# EasyEDA Pro project Smart_Plugs.eprj

# Schematic MAIN_IO_EXPANDER
Create Date: 2026-02-11; Page Name: MAIN_IO_EXPANDER; Project Name: Smart_Plugs; Schematic Name: MAIN_IO_EXPANDER; Update Date: 2026-02-14; Address1: *; Address2: *; Address3: *; Address4: *; Application_BuildNumber: *; ApprovedBy: *; Author: *; CheckedBy: *; CompanyName: *; CurrentDate: *; CurrentTime: *; Date: *; DocumentFullPathAndName: *; DocumentName: *; DocumentNumber: *; DrawnBy: *; Engineer: *; ImagePath: *; ModifiedDate: *; Organization: *; ProjectName: *; Revision: *; Rule: *; SheetNumber: 8; SheetTotal: 10; Time: *; Title: *
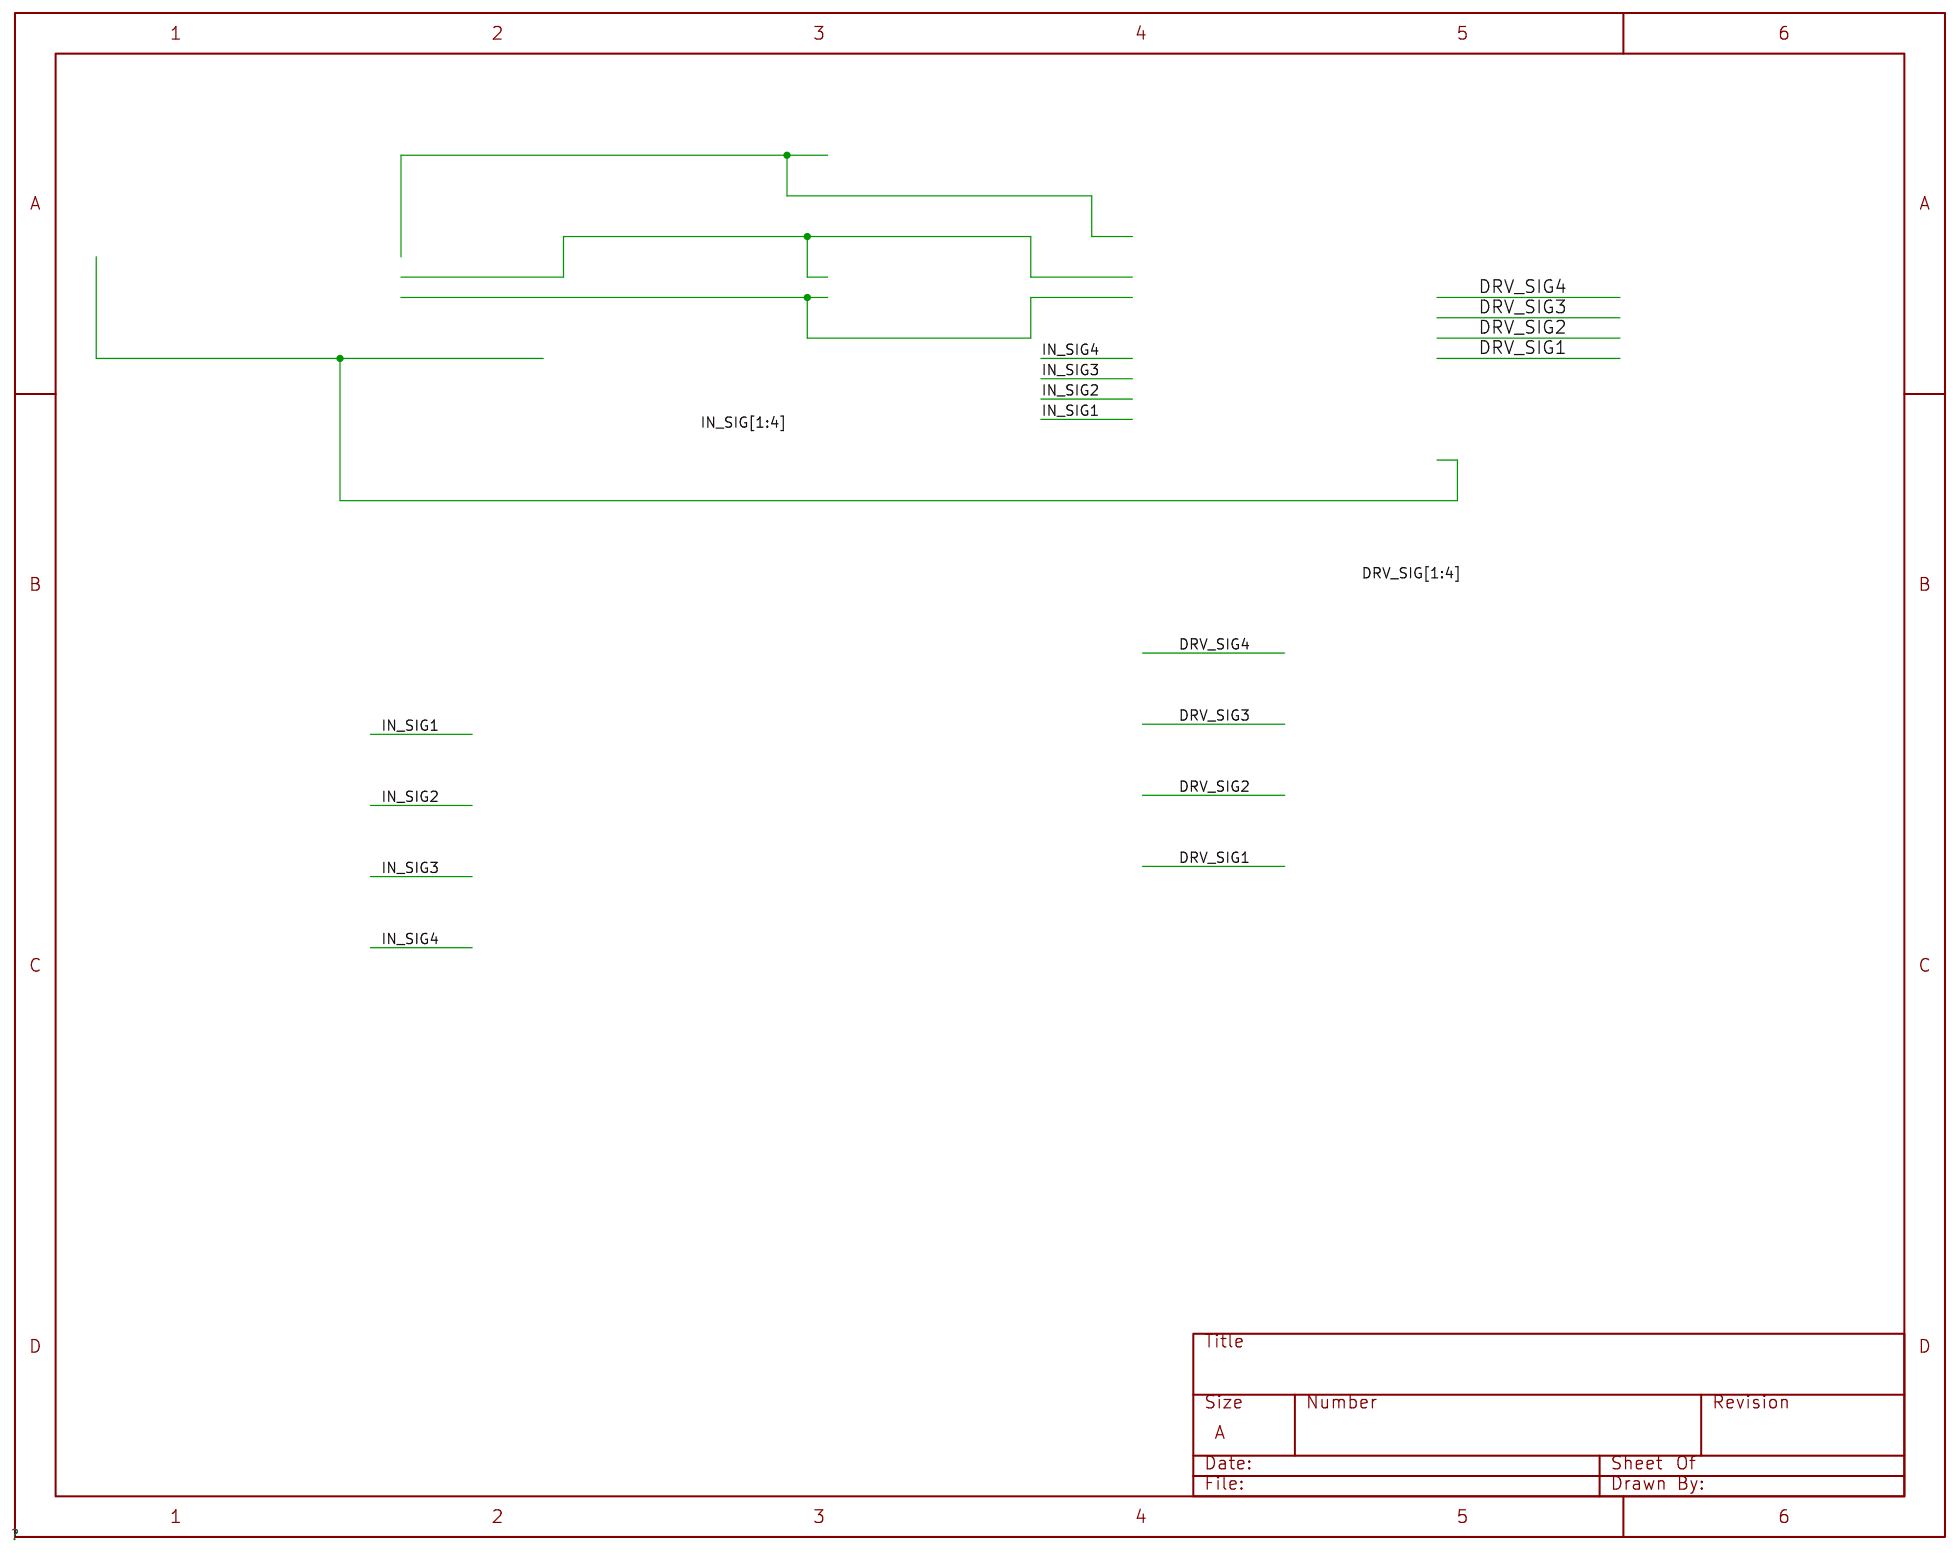
[diagram p0: schematic sheet]

## Parts
Button_Input_Block1  -
Button_Input_Block2  -
Button_Input_Block3  -
Button_Input_Block4  -
RELAY_CHANNEL1  -
RELAY_CHANNEL2  -
RELAY_CHANNEL3  -
RELAY_CHANNEL4  -
U_Earth_Connectors  Earth_Connectors
U_I2C  I2C
U_IO_Expander  IO_Expander
U_IO_Expander_Interrupt_Block101  IO_Expander_Interrupt_Block
U_PSU  PSU
U_System_Controller  System_Controller

## Library data of the parts
U_Earth_Connectors = -: File: Earth_Connectors.SchDoc
U_I2C = -: File: I2C.SchDoc
U_IO_Expander = -: File: IO_Expander.SchDoc
U_IO_Expander_Interrupt_Block101 = -: File: IO_Expander_Interrupt_Block.SchDoc
U_PSU = -: File: PSU.SchDoc
U_System_Controller = -: File: System_Controller.SchDoc

## Nets
DRV_SIG1: Button_Input_Block1.(IN_SIG) Button_Input_Block2.(IN_SIG) Button_Input_Block3.(IN_SIG) Button_Input_Block4.(IN_SIG) U_I2C.(I2C_SDA) U_IO_Expander.(MCP_INT_OUT) U_IO_Expander_Interrupt_Block101.(MCP_INT) U_System_Controller.(I2C_SCL)

Not connected (* = marked no-connect by the designer): RELAY_CHANNEL1 (LED_IND_IN); RELAY_CHANNEL2 (LED_IND_IN); RELAY_CHANNEL3 (LED_IND_IN); RELAY_CHANNEL4 (LED_IND_IN); U_Earth_Connectors (AC_PE); U_PSU (AC_N_FILTERED_OUT)

# Schematic PSU_Input_EMI_Protection_Block
Create Date: 2026-02-11; Page Name: PSU_Input_EMI_Protection; Project Name: Smart_Plugs; Schematic Name: PSU_Input_EMI_Protection_Block; Update Date: 2026-03-02; Address1: *; Address2: *; Address3: *; Address4: *; Application_BuildNumber: *; ApprovedBy: *; Author: *; CheckedBy: *; CompanyName: *; CurrentDate: *; CurrentTime: *; Date: *; DocumentFullPathAndName: *; DocumentName: *; DocumentNumber: *; DrawnBy: *; Engineer: *; ImagePath: *; ModifiedDate: *; Organization: *; Parameter 1: *; ProjectName: *; Revision: *; Rule: *; SheetNumber: 2; SheetTotal: 10; Time: *; Title: *
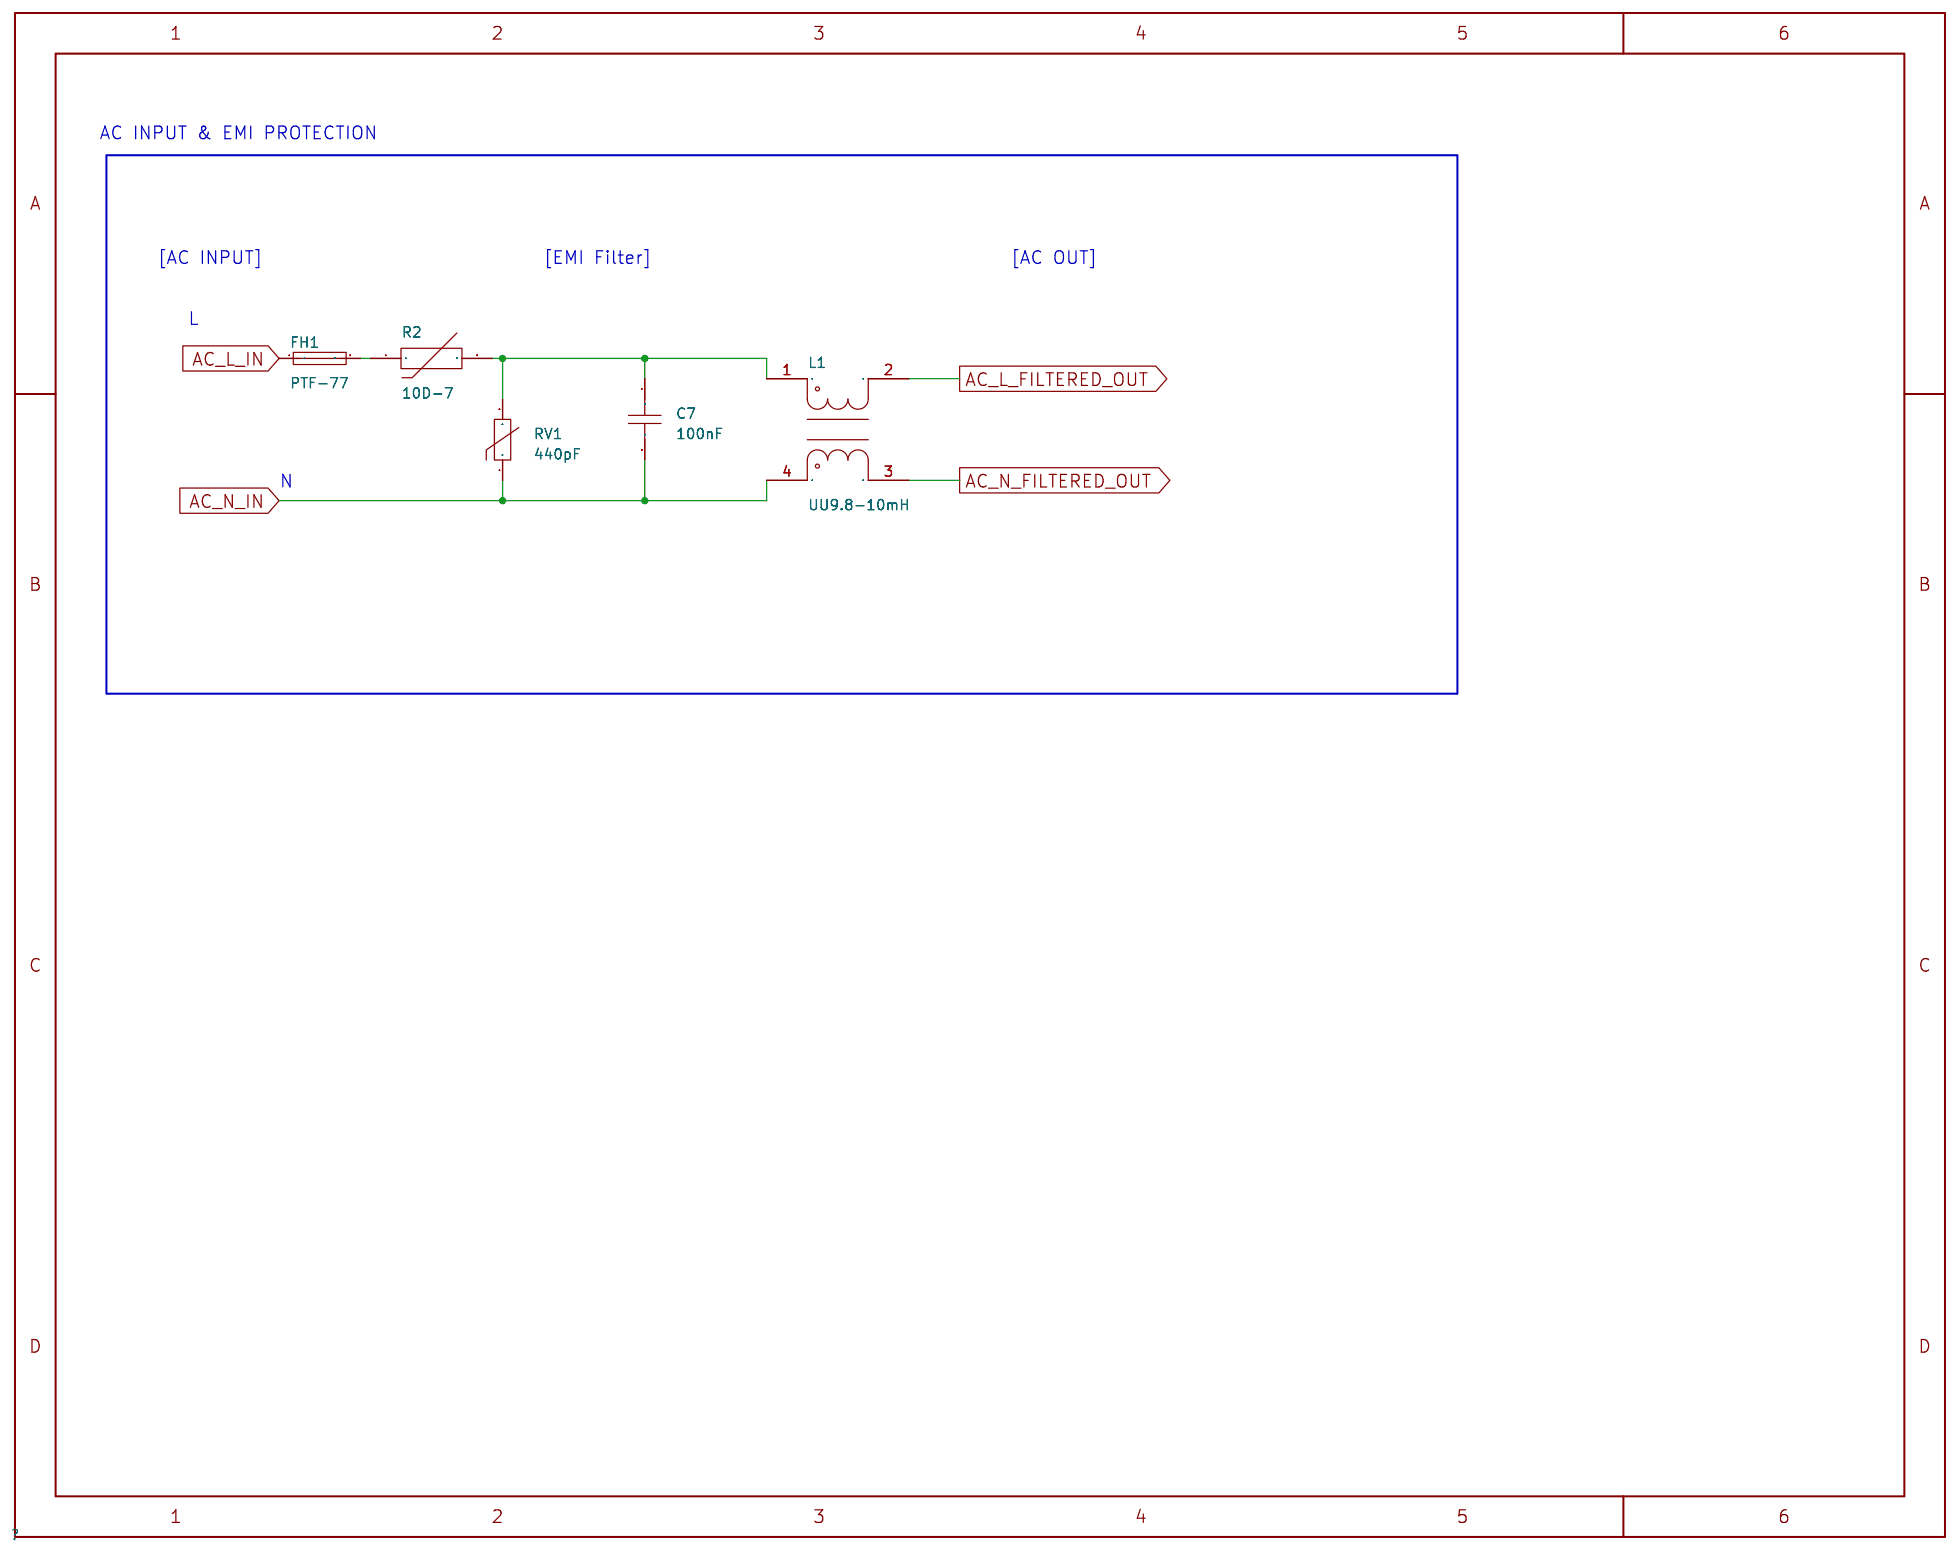
[diagram p1: schematic sheet]

## Parts
C7  100nF  [CAP-TH_L13.0-W6.0-P10.00-D1.0]
FH1  PTF-77  [FUSE-TH_L24.4-W9.4-P22.60]
L1  UU9.8-10mH  [FILTER-TH_4P-L17.0-W12.0-P7.00-D0.6-S8.00]
R2  10D-7  [RES-TH_L9.0-W4.7-P5.00-D1.2-S1.70]
RV1  440pF  [RES-TH_L14.5-W6.0-P7.50-D0.8-S6.0]

## Library data of the parts
C7 = MP2104K27C3X6LC: LCSC Part Name: 100nF ±10% 275V 等级:X2; Supplier Part: C105759; Manufacturer: SRD(圣融达); Supplier Footprint: 插件,P=10mm; JLCPCB Part Class: Extended Part; Datasheet: https://item.szlcsc.com/datasheet/MP2104K27C3X6LC/106974.html; Supplier: LCSC; Tolerance: ±10%; Voltage(AC): 275V; Ratings: X2; safety certification: UL；ENEC；VDE；CQC；CSA
FH1 = PTF-77: LCSC Part Name: 2件套 保险丝座 5x20mm 绿色; Supplier Part: C717030; Manufacturer: XFCN(兴飞); Supplier Footprint: 插件,P=22.5mm; JLCPCB Part Class: Extended Part; Datasheet: https://item.szlcsc.com/datasheet/PTF-77/757629.html; Supplier: LCSC; Fuseholder Type: Bracket type; Number of Circuits: 1; Voltage Rating: 250V; Current Rating: 20A; Fuse Type: Cylindrical; Fuse Diameter (φD): 5mm; Fuse Length: 20mm
L1 = UU9.8-10mH: LCSC Part Name: 两路 插件共模滤波器; Supplier Part: C148474; Manufacturer: FH(风华); Supplier Footprint: DIP-4P,17x12mm; Datasheet: https://item.szlcsc.com/datasheet/UU9.8-10mH/159808.html; Supplier: LCSC; Number of Lines: 2; Voltage Withstand: 1kV; Current Rating: 500mA; Inductance @ Frequency: 10mH@1kHz; DC Resistance(DCR): 800mΩ; Operating Temperature: -25℃~+85℃; Insulation Resistance(IR): 100MΩ
R2 = 10D-7: LCSC Part Name: 10Ω 2700K NTC热敏电阻; Supplier Part: C332360; Manufacturer: HEL(鸿志); Supplier Footprint: 插件,P=5mm; JLCPCB Part Class: Extended Part; Datasheet: https://item.szlcsc.com/datasheet/10D-7/311113.html; Supplier: LCSC; Resistance @ 25℃: 10Ω; B Constant (25℃/50℃): 2700K; B Constant (25℃/85℃): 2700K; Steady State Current (Max): 1A; Operating Temperature: -40℃~+150℃; Dissipation Factor: 6mW/℃; Thermal Time Constant: 20s; Pitch: 5mm
RV1 = 14D431K_C49069732: LCSC Part Name: 710V 136J; Supplier Part: C49069732; Manufacturer: R+O(宏嘉诚); Manufacturer Part: 14D431K; Supplier Footprint: 插件,P=7.5mm; JLCPCB Part Class: Extended Part; Datasheet: https://item.szlcsc.com/datasheet/14D431K/51445298.html; Supplier: LCSC; Varistor Voltage: 387V~473V; Clamping Voltage: 710V; Maximum DC Volts: 350V; Maximum AC Volts: 275V; Peak Current: 4.5kA; Energy: 136J; Rated Wattage: 600mW

## Nets
AC_L_FILTERED_OUT: L1.2
AC_L_IN: FH1.1
AC_N_FILTERED_OUT: L1.3
AC_N_IN: C7.2 L1.4 RV1.1
Net-(C7-1): C7.1 L1.1 R2.2 RV1.2
Net-(FH1-2): FH1.2 R2.1

## Notes on the sheet
- AC INPUT & EMI PROTECTION
- [AC INPUT]
- [EMI Filter]
- [AC OUT]
- L
- N

# Schematic Relay_Channel_HF115F
Create Date: 2026-02-11; Page Name: Relay_Channel_HF115F; Project Name: Smart_Plugs; Schematic Name: Relay_Channel_HF115F; Update Date: 2026-03-13; Address1: *; Address2: *; Address3: *; Address4: *; Application_BuildNumber: *; ApprovedBy: *; Author: *; CheckedBy: *; CompanyName: *; CurrentDate: *; CurrentTime: *; Date: *; DocumentFullPathAndName: *; DocumentName: *; DocumentNumber: *; DrawnBy: *; Engineer: *; ImagePath: *; ModifiedDate: *; Organization: *; ProjectName: *; Revision: *; Rule: *; SheetNumber: 8; SheetTotal: 10; Time: *; Title: *
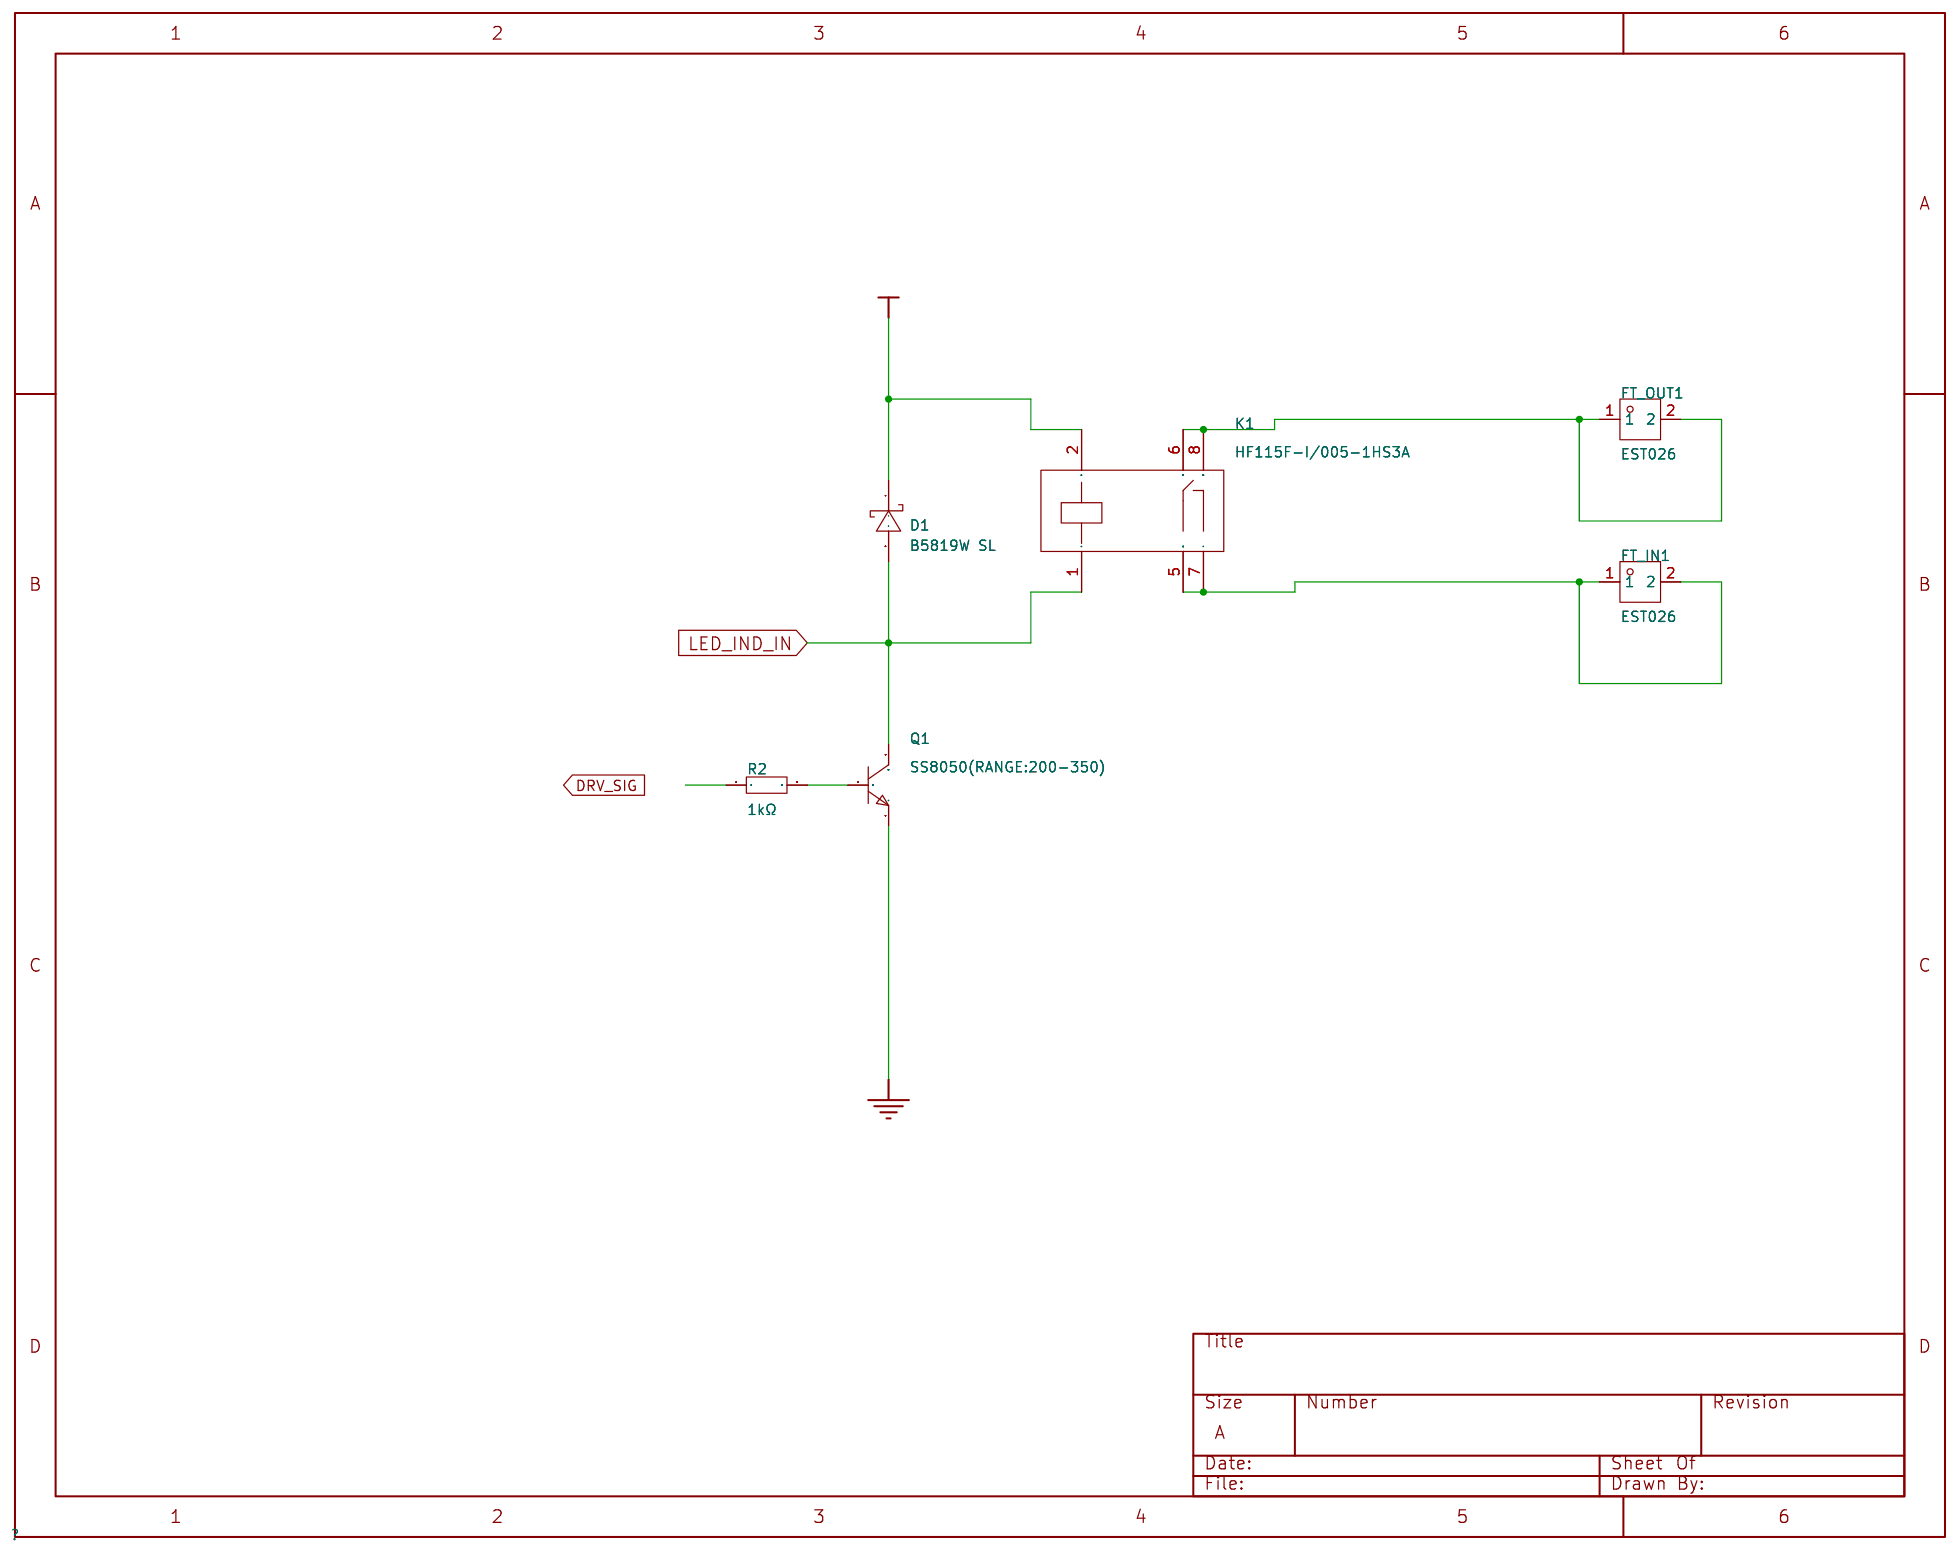
[diagram p2: schematic sheet]

## Parts
D1  B5819W SL  [SOD-123_L2.7-W1.6-LS3.7-RD-1]
FT_IN1  EST026  [CONN-TH_L6.3-W0.8-EST026]
FT_OUT1  EST026  [CONN-TH_L6.3-W0.8-EST026]
K1  HF115F-I/005-1HS3A  [RELAY-TH_HF115F-XXX-1HS3]
Q1  SS8050(RANGE:200-350)  [SOT-23-3_L2.9-W1.3-P1.90-LS2.4-BR]
R2  1kΩ  [R0805]

## Library data of the parts
D1 = B5819W SL: LCSC Part Name: 电压:40V 电流:1A; Supplier Part: C8598; Manufacturer: CJ(江苏长电/长晶); Supplier Footprint: SOD-123; Datasheet: https://item.szlcsc.com/datasheet/B5819W%2520SL/9093.html; Supplier: LCSC; Voltage - Forward(Vf@If): 600mV@1A; Voltage - DC Reverse(Vr): 40V; Current - Rectified: 1A; Non-Repetitive Peak Forward Surge Current: 9A
FT_IN1 FT_OUT1 = EST026: LCSC Part Name: 插片端子-6.3mm; Supplier Part: C52878; Manufacturer: xcfuse(旭程); Supplier Footprint: 插件; JLCPCB Part Class: Extended Part; Datasheet: https://item.szlcsc.com/datasheet/EST026/53893.html; Supplier: LCSC
K1 = HF115F-I/005-1HS3A: LCSC Part Name: 小型大功率5V继电器 单刀单掷-常开 TV-5; Supplier Part: C2976795; Manufacturer: HF(宏发); Supplier Footprint: DIP,29x12.7mm; JLCPCB Part Class: Extended Part; Datasheet: https://item.szlcsc.com/datasheet/HF115F-I%252F005-1HS3A/3385015.html; Supplier: LCSC; Coil Voltage: 5V; Contact Form: 1 Set Normally Open: 1A (SPST NO); Number of Pins: 6; Contact Rating: 16A@250VAC; Switching Voltage(Max): 440V@AC；300V@DC; Coil Rated Power: 400mW; Contact Material: AgSnO2; Switching Current(Max): 16A; Coil Type: Non-Polarized - Single Coil; Coil Resistance: 62Ω; Contact Resistance: 100mΩ; Operate Time: 15ms; Release Time: 8ms; Operating Temperature: -40℃~+85℃
Q1 = SS8050(RANGE:200-350)_C2150: LCSC Part Name: hfe=200~350 NPN 电流:1.5A 电压:25V; Supplier Part: C2150; Manufacturer: CJ(江苏长电/长晶); Supplier Footprint: SOT-23; JLCPCB Part Class: Basic Part; Datasheet: https://item.szlcsc.com/datasheet/SS8050(RANGE%253A200-350)/2507.html; Supplier: LCSC; type: NPN; Current - Collector(Ic): 1.5A; Collector - Emitter Voltage VCEO: 25V; Pd - Power Dissipation: 300mW; DC Current Gain: 200@800mA,1V; Transition frequency(fT): 100MHz; Current - Collector Cutoff: 100nA; Vce Saturation(VCE(sat)): 500mV@800mA,80mA; Operating Temperature: -55℃~+150℃; Emitter-Base Voltage(Vebo): 5V; Number: 1 NPN
R2 = 0805W8F1001T5E: LCSC Part Name: 1kΩ ±1% 125mW 厚膜电阻; Supplier Part: C17513; Manufacturer: UNI-ROYAL(厚声); Supplier Footprint: 0805; Datasheet: https://atta.szlcsc.com/upload/public/pdf/source/20200306/C422600_1E6D84923E4A46A82E41ADD87F860B5C.pdf; Supplier: LCSC; Type: Thick Film Resistors; Tolerance: ±1%; Temperature Coefficient: ±100ppm/℃; Operating Temperature Range: -55℃~+155℃

## Nets
+5V: D1.1(-) K1.2
GND: Q1.2(E)
DRV_SIG: R2.1
LED_IND_IN: D1.2(+) K1.1 Q1.3(C)
Net-(FT_IN1-1): FT_IN1.1 FT_IN1.2 K1.5 K1.7
Net-(FT_OUT1-1): FT_OUT1.1 FT_OUT1.2 K1.6 K1.8
Net-(Q1-1): Q1.1(B) R2.2

# Schematic IO_Expander_1
Create Date: 2026-02-11; Page Name: IO_Expander; Project Name: Smart_Plugs; Schematic Name: IO_Expander_1; Update Date: 2026-02-11; Address1: *; Address2: *; Address3: *; Address4: *; Application_BuildNumber: *; ApprovedBy: *; Author: *; CheckedBy: *; CompanyName: *; CurrentDate: *; CurrentTime: *; Date: *; DocumentFullPathAndName: *; DocumentName: *; DocumentNumber: *; DrawnBy: *; Engineer: *; ImagePath: *; ModifiedDate: *; Organization: *; ProjectName: *; Revision: *; Rule: *; SheetNumber: 8; SheetTotal: 10; Time: *; Title: *
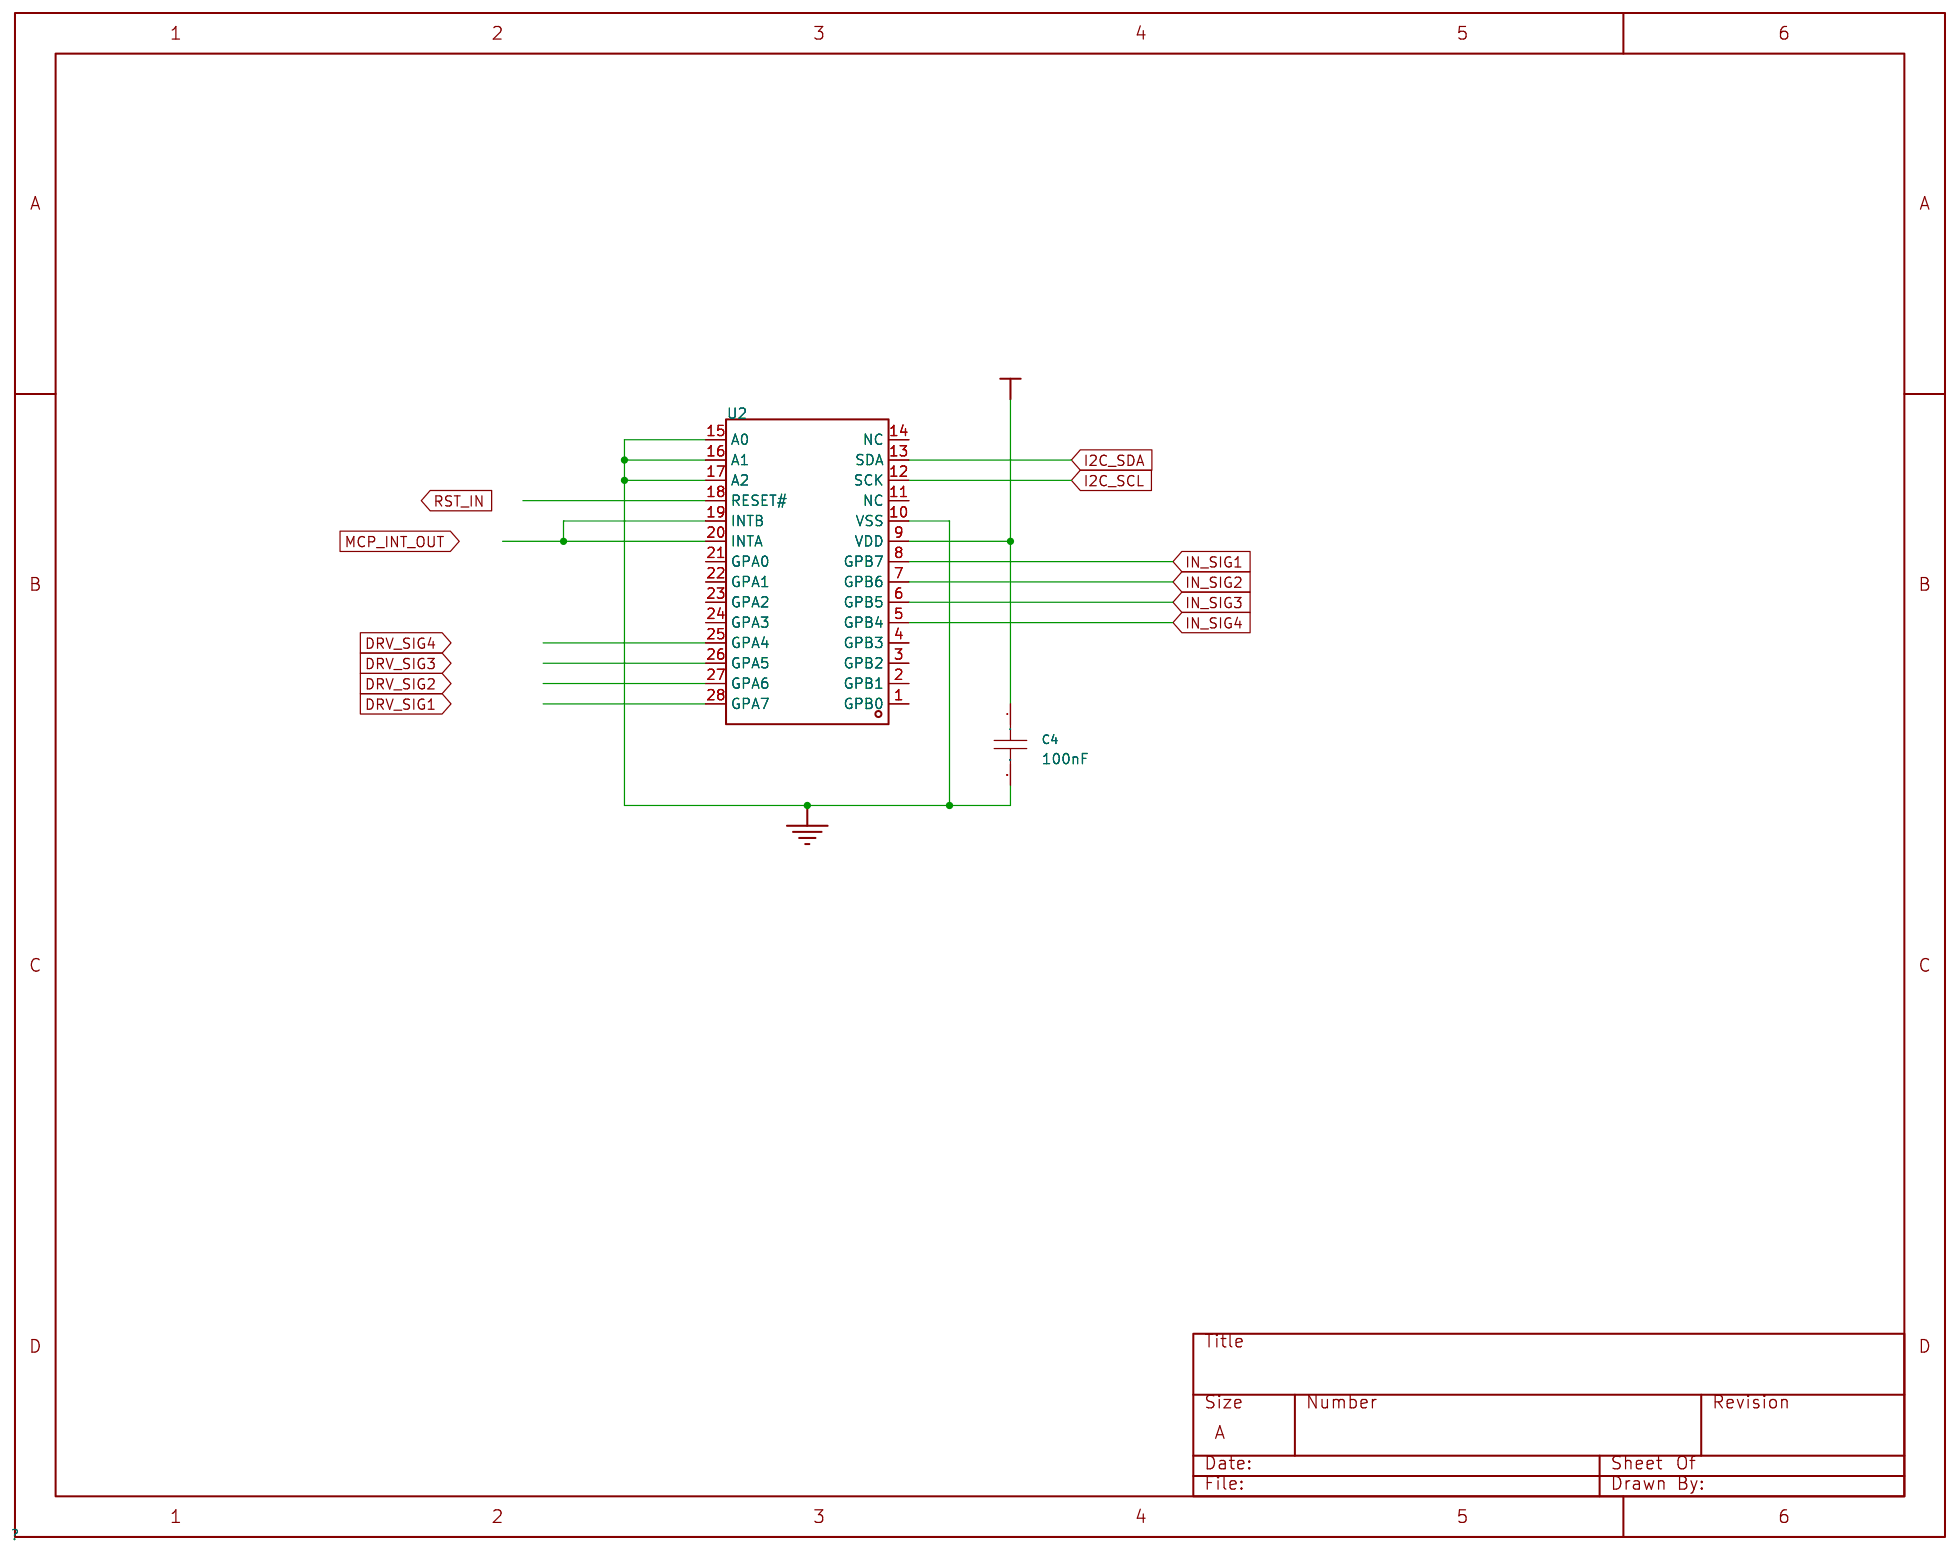
[diagram p3: schematic sheet]

## Parts
C4  100nF  [CAP-TH_L4.0-W2.5-P5.00-D1.0]
U2  MCP23017-E/SS  [SSOP-28_L10.2-W5.3-P0.65-LS7.8-BL]

## Library data of the parts
C4 = FG28X7R1H104KNT06: LCSC Part Name: 100nF ±10% 50V; Supplier Part: C342794; Manufacturer: TDK; Supplier Footprint: 插件,P=5mm; JLCPCB Part Class: Extended Part; Datasheet: https://item.szlcsc.com/datasheet/FG28X7R1H104KNT06/319644.html; Supplier: LCSC; Tolerance: ±10%; Voltage Rating: 50V; Temperature Coefficient: X7R; Pin Spacing: 5mm
U2 = MCP23017-E/SS: LCSC Part Name: 16位带串行接口的I/O扩展器; Manufacturer: MICROCHIP(美国微芯); JLCPCB Part Class: Extended Part; Datasheet: https://item.szlcsc.com/datasheet/MCP23017-E%252FSS/519857.html; Interface: I2C; Number of I/O: 16; Interrupt Output: Interrupt Output; Voltage - Supply: 1.8V~5.5V; Current - Output Low(IOL): 8mA; Clock Frequency: 1.7MHz; Operating Temperature: -40℃~+125℃; Number of Supporting Devices: 8; Quiescent Current: 1uA; Output Logic Level - Low: 600mV; Supplier Part: C506653; Supplier Footprint: SSOP-28(5.3x10.2x0.65); Supplier: LCSC; Library Name: MCP23017-E-SS

## Nets
+3V3: C4.1 U2.9(VDD)
GND: C4.2 U2.10(VSS) U2.15(A0) U2.16(A1) U2.17(A2)
DRV_SIG1: U2.28(GPA7)
DRV_SIG2: U2.27(GPA6)
DRV_SIG3: U2.26(GPA5)
DRV_SIG4: U2.25(GPA4)
I2C_SCL: U2.12(SCK)
I2C_SDA: U2.13(SDA)
IN_SIG1: U2.8(GPB7)
IN_SIG2: U2.7(GPB6)
IN_SIG3: U2.6(GPB5)
IN_SIG4: U2.5(GPB4)
MCP_INT_OUT: U2.19(INTB) U2.20(INTA)
RST_IN: U2.18(RESET#)

Not connected (* = marked no-connect by the designer): U2 1(GPB0) 2(GPB1) 3(GPB2) 4(GPB3) 11(NC) 14(NC) 21(GPA0) 22(GPA1) 23(GPA2) 24(GPA3)

# Schematic I2C
Create Date: 2026-02-11; Page Name: I2C; Project Name: Smart_Plugs; Schematic Name: I2C; Update Date: 2026-02-14; Address1: *; Address2: *; Address3: *; Address4: *; Application_BuildNumber: *; ApprovedBy: *; Author: *; CheckedBy: *; CompanyName: *; CurrentDate: *; CurrentTime: *; Date: *; DocumentFullPathAndName: *; DocumentName: *; DocumentNumber: *; DrawnBy: *; Engineer: *; ImagePath: *; ModifiedDate: *; Organization: *; ProjectName: *; Revision: *; Rule: *; SheetNumber: 8; SheetTotal: 10; Time: *; Title: *
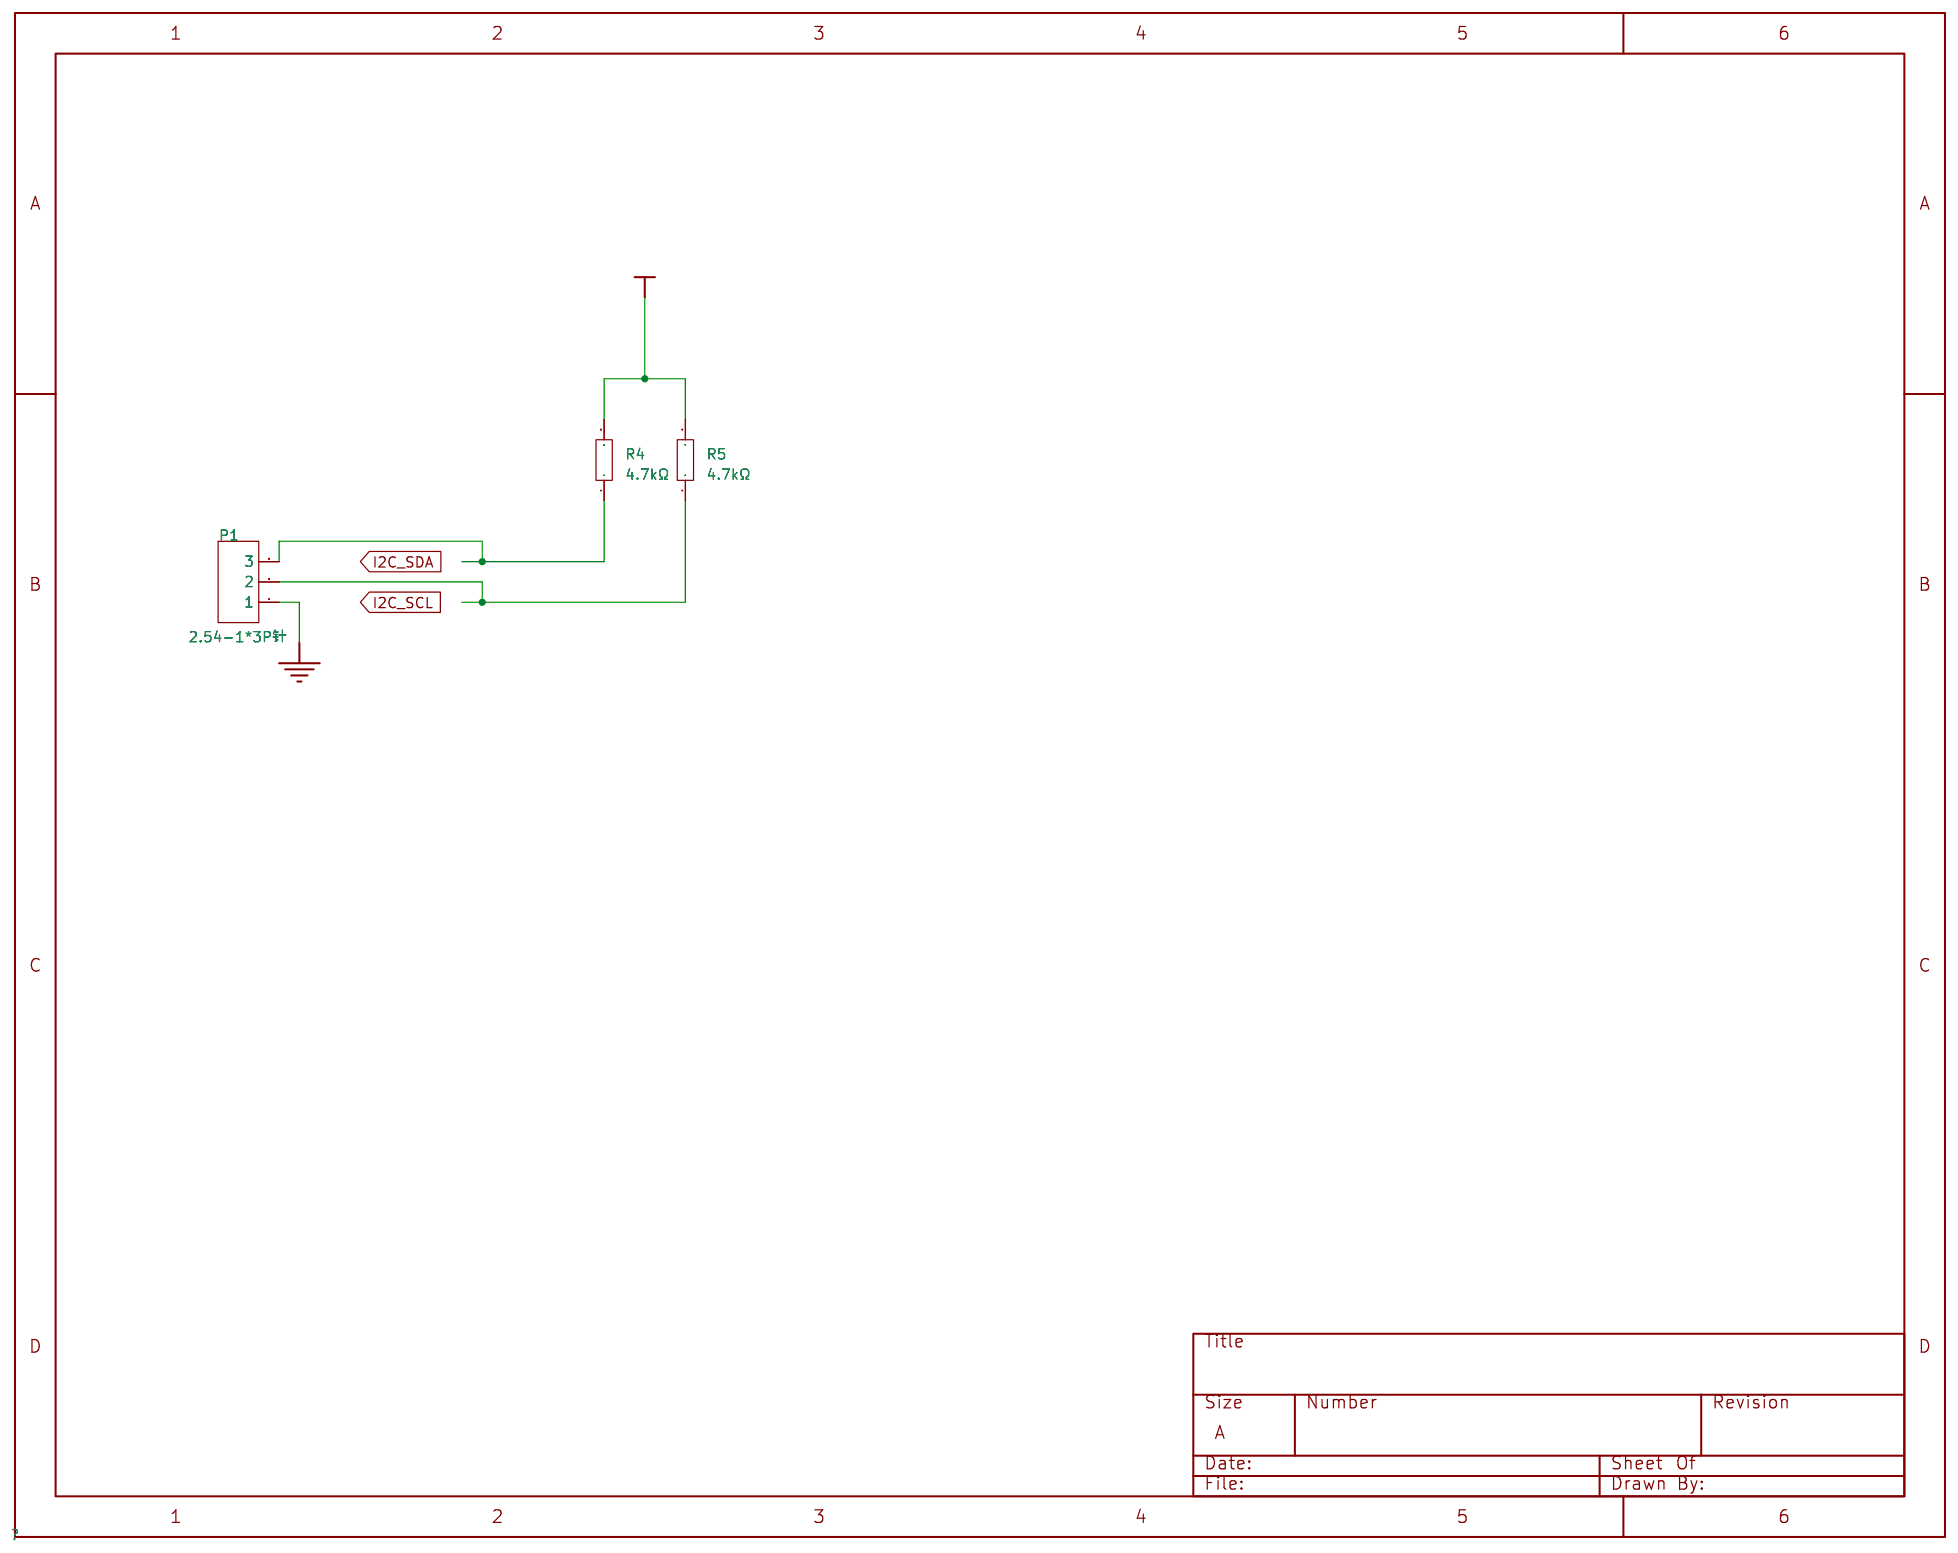
[diagram p4: schematic sheet]

## Parts
P1  2.54-1*3P针  [HDR-TH_3P-P2.54-V-M-1]
R4  4.7kΩ  [R0805]
R5  4.7kΩ  [R0805]

## Library data of the parts
P1 = 2.54-1*3P针: LCSC Part Name: 1x3P 间距:2.54mm 方针 直插; Supplier Part: C49257; Manufacturer: BOOMELE(博穆精密); Supplier Footprint: 插件,P=2.54mm; JLCPCB Part Class: Extended Part; Datasheet: https://item.szlcsc.com/datasheet/2.54-1*3P%25E9%2592%2588/50265.html; Supplier: LCSC; Pin Structure: 1x3P; Pitch: 2.54mm; Circluar Pins/Square Pins: Pin Header; Mounting Type: Through Hole; Number of Rows: 1; Number of Pins: 3P; Current Rating: 3A; Length of Mating Pin: 6mm; Insulation Height: 2.5mm; Length of End Connection Pin: 3mm; Contact Material: Brass; Contact Plating: Gold; Operating Temperature: -40℃~+105℃; Color: Black
R4 R5 = 0805W8F4701T5E: LCSC Part Name: 4.7kΩ ±1% 125mW 厚膜电阻; Supplier Part: C17673; Manufacturer: UNI-ROYAL(厚声); Supplier Footprint: 0805; JLCPCB Part Class: Basic Part; Datasheet: https://atta.szlcsc.com/upload/public/pdf/source/20200306/C422600_1E6D84923E4A46A82E41ADD87F860B5C.pdf; Supplier: LCSC; Type: Thick Film Resistors; Tolerance: ±1%; Temperature Coefficient: ±100ppm/℃; Operating Temperature Range: -55℃~+155℃

## Nets
+3V3: R4.2 R5.2
GND: P1.1
I2C_SCL: P1.2 R5.1
I2C_SDA: P1.3 R4.1

# Schematic IO_Expander_Interrupt_Block_1
Create Date: 2026-02-11; Page Name: IO_Expander_Interrupt_Block; Project Name: Smart_Plugs; Schematic Name: IO_Expander_Interrupt_Block_1; Update Date: 2026-02-14; Address1: *; Address2: *; Address3: *; Address4: *; Application_BuildNumber: *; ApprovedBy: *; Author: *; CheckedBy: *; CompanyName: *; CurrentDate: *; CurrentTime: *; Date: *; DocumentFullPathAndName: *; DocumentName: *; DocumentNumber: *; DrawnBy: *; Engineer: *; ImagePath: *; ModifiedDate: *; Organization: *; ProjectName: *; Revision: *; Rule: *; SheetNumber: 8; SheetTotal: 10; Time: *; Title: *
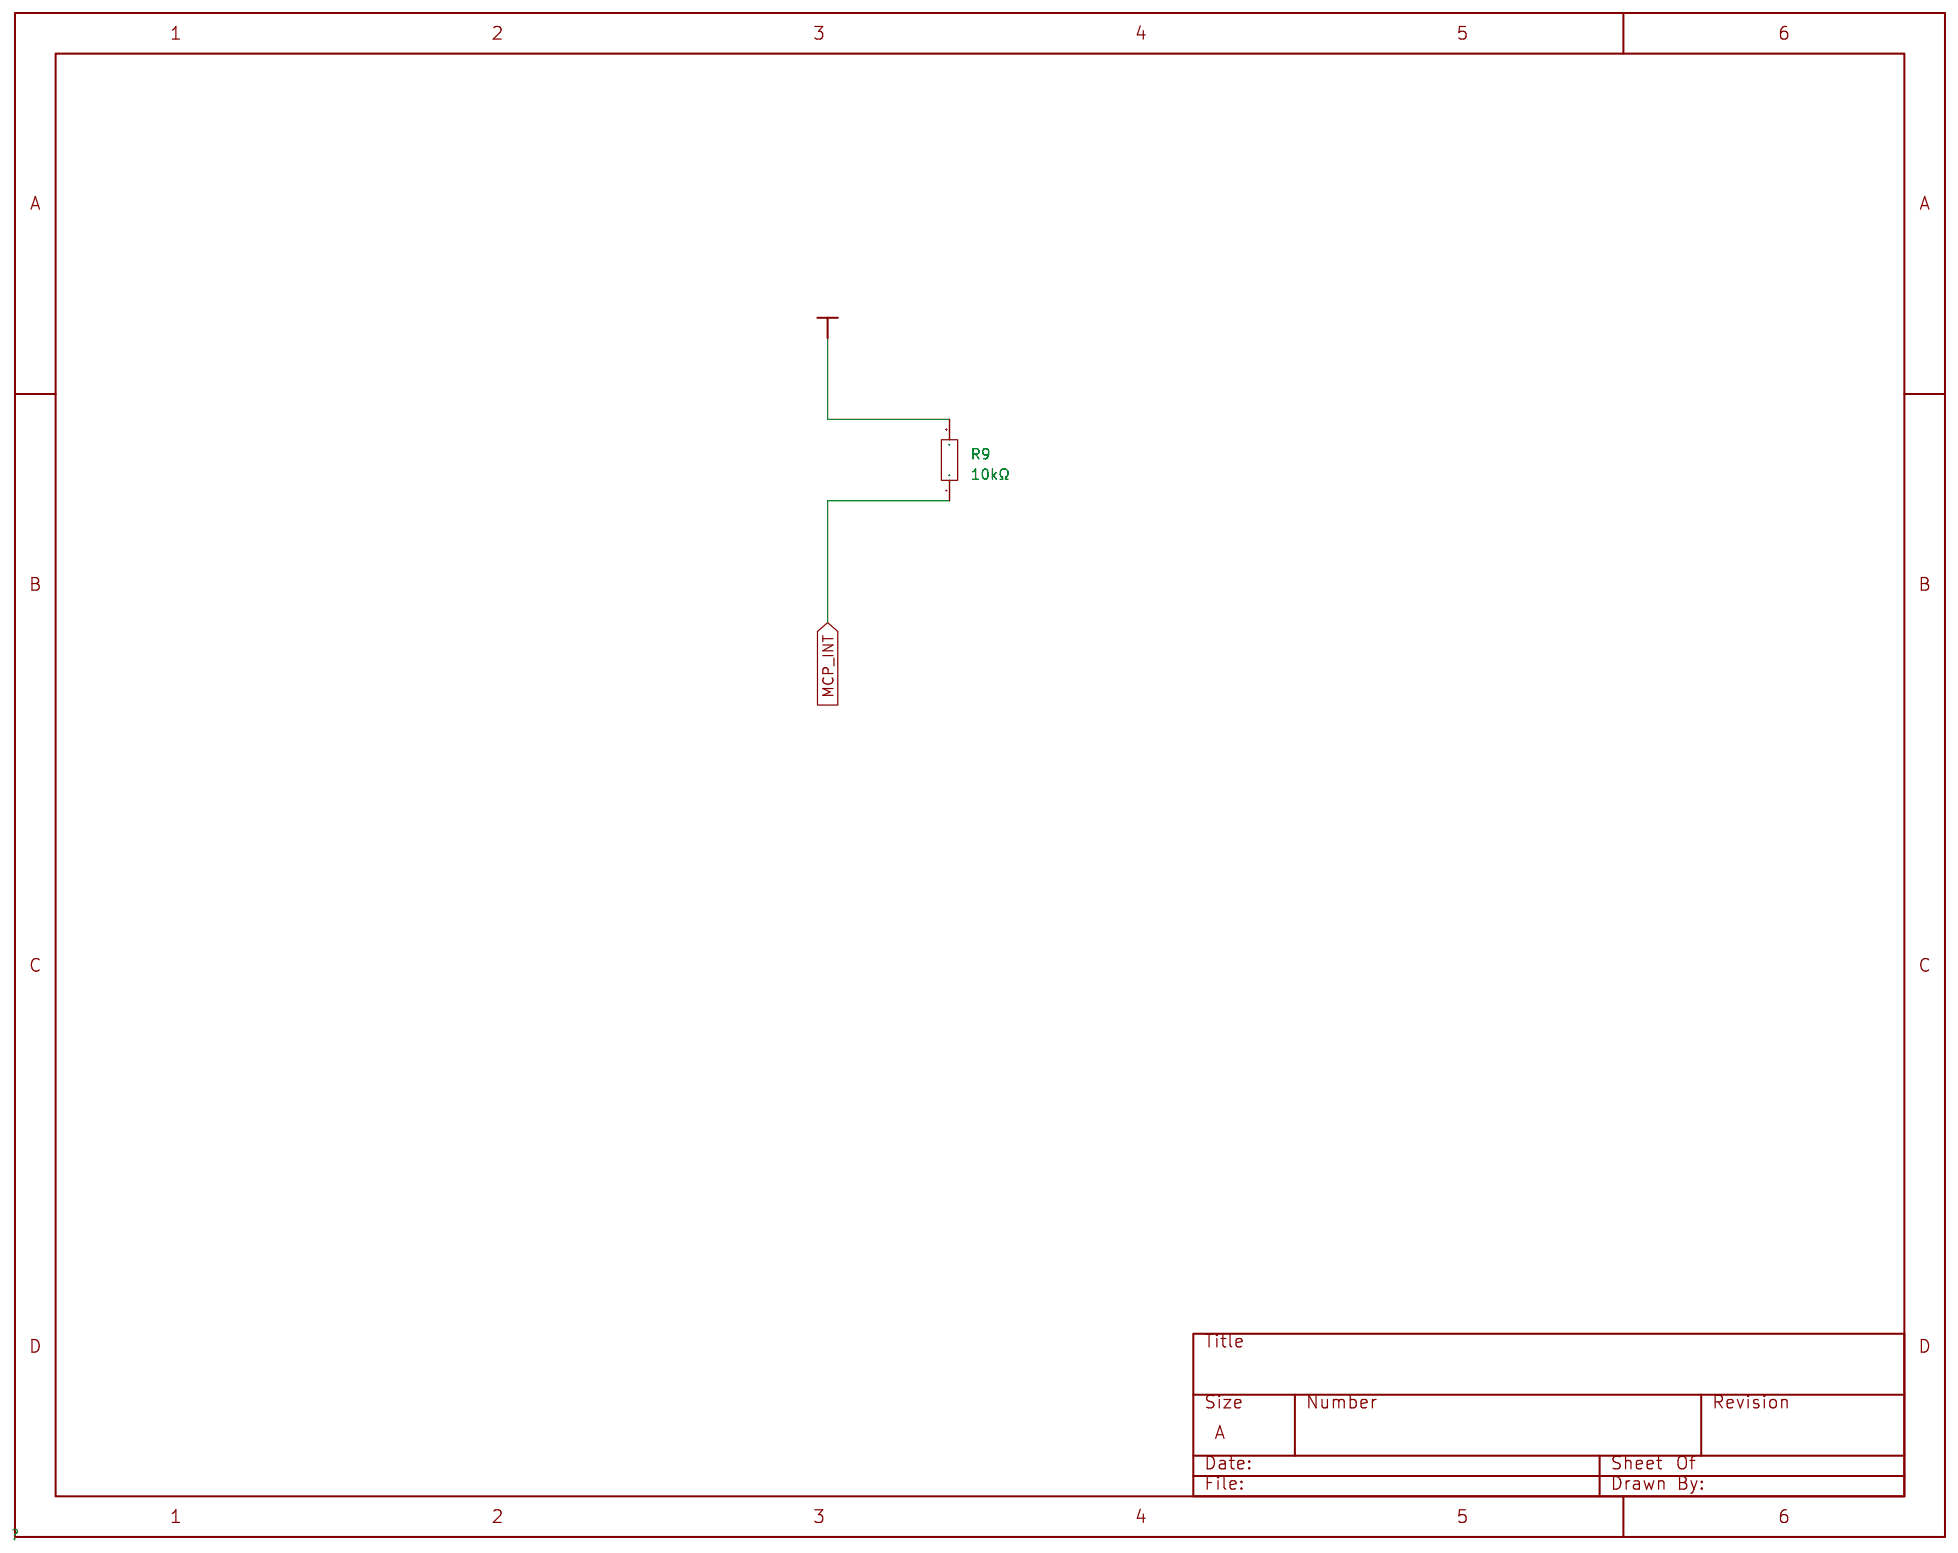
[diagram p5: schematic sheet]

## Parts
R9  10kΩ  [R0805]

## Library data of the parts
R9 = 0805W8F1002T5E: LCSC Part Name: 10kΩ ±1% 125mW 厚膜电阻; Supplier Part: C17414; Manufacturer: UNI-ROYAL(厚声); Supplier Footprint: 0805; JLCPCB Part Class: Basic Part; Datasheet: https://item.szlcsc.com/datasheet/0805W8F1002T5E/18102.html; Supplier: LCSC; Type: Thick Film Resistor; Tolerance: ±1%; Power(Watts): 125mW; Voltage-Supply(Max): 150V; Temperature Coefficient: ±100ppm/℃; Operating Temperature: -55℃~+155℃

## Nets
+3V3: R9.2
MCP_INT: R9.1

# Schematic System_Controller_Header
Create Date: 2026-02-11; Page Name: System_Controller_Header; Project Name: Smart_Plugs; Schematic Name: System_Controller_Header; Update Date: 2026-02-14; Address1: *; Address2: *; Address3: *; Address4: *; Application_BuildNumber: *; ApprovedBy: *; Author: *; CheckedBy: *; CompanyName: *; CurrentDate: *; CurrentTime: *; Date: *; DocumentFullPathAndName: *; DocumentName: *; DocumentNumber: *; DrawnBy: *; Engineer: *; ImagePath: *; ModifiedDate: *; Organization: *; ProjectName: *; Revision: *; Rule: *; SheetNumber: 8; SheetTotal: 10; Time: *; Title: *
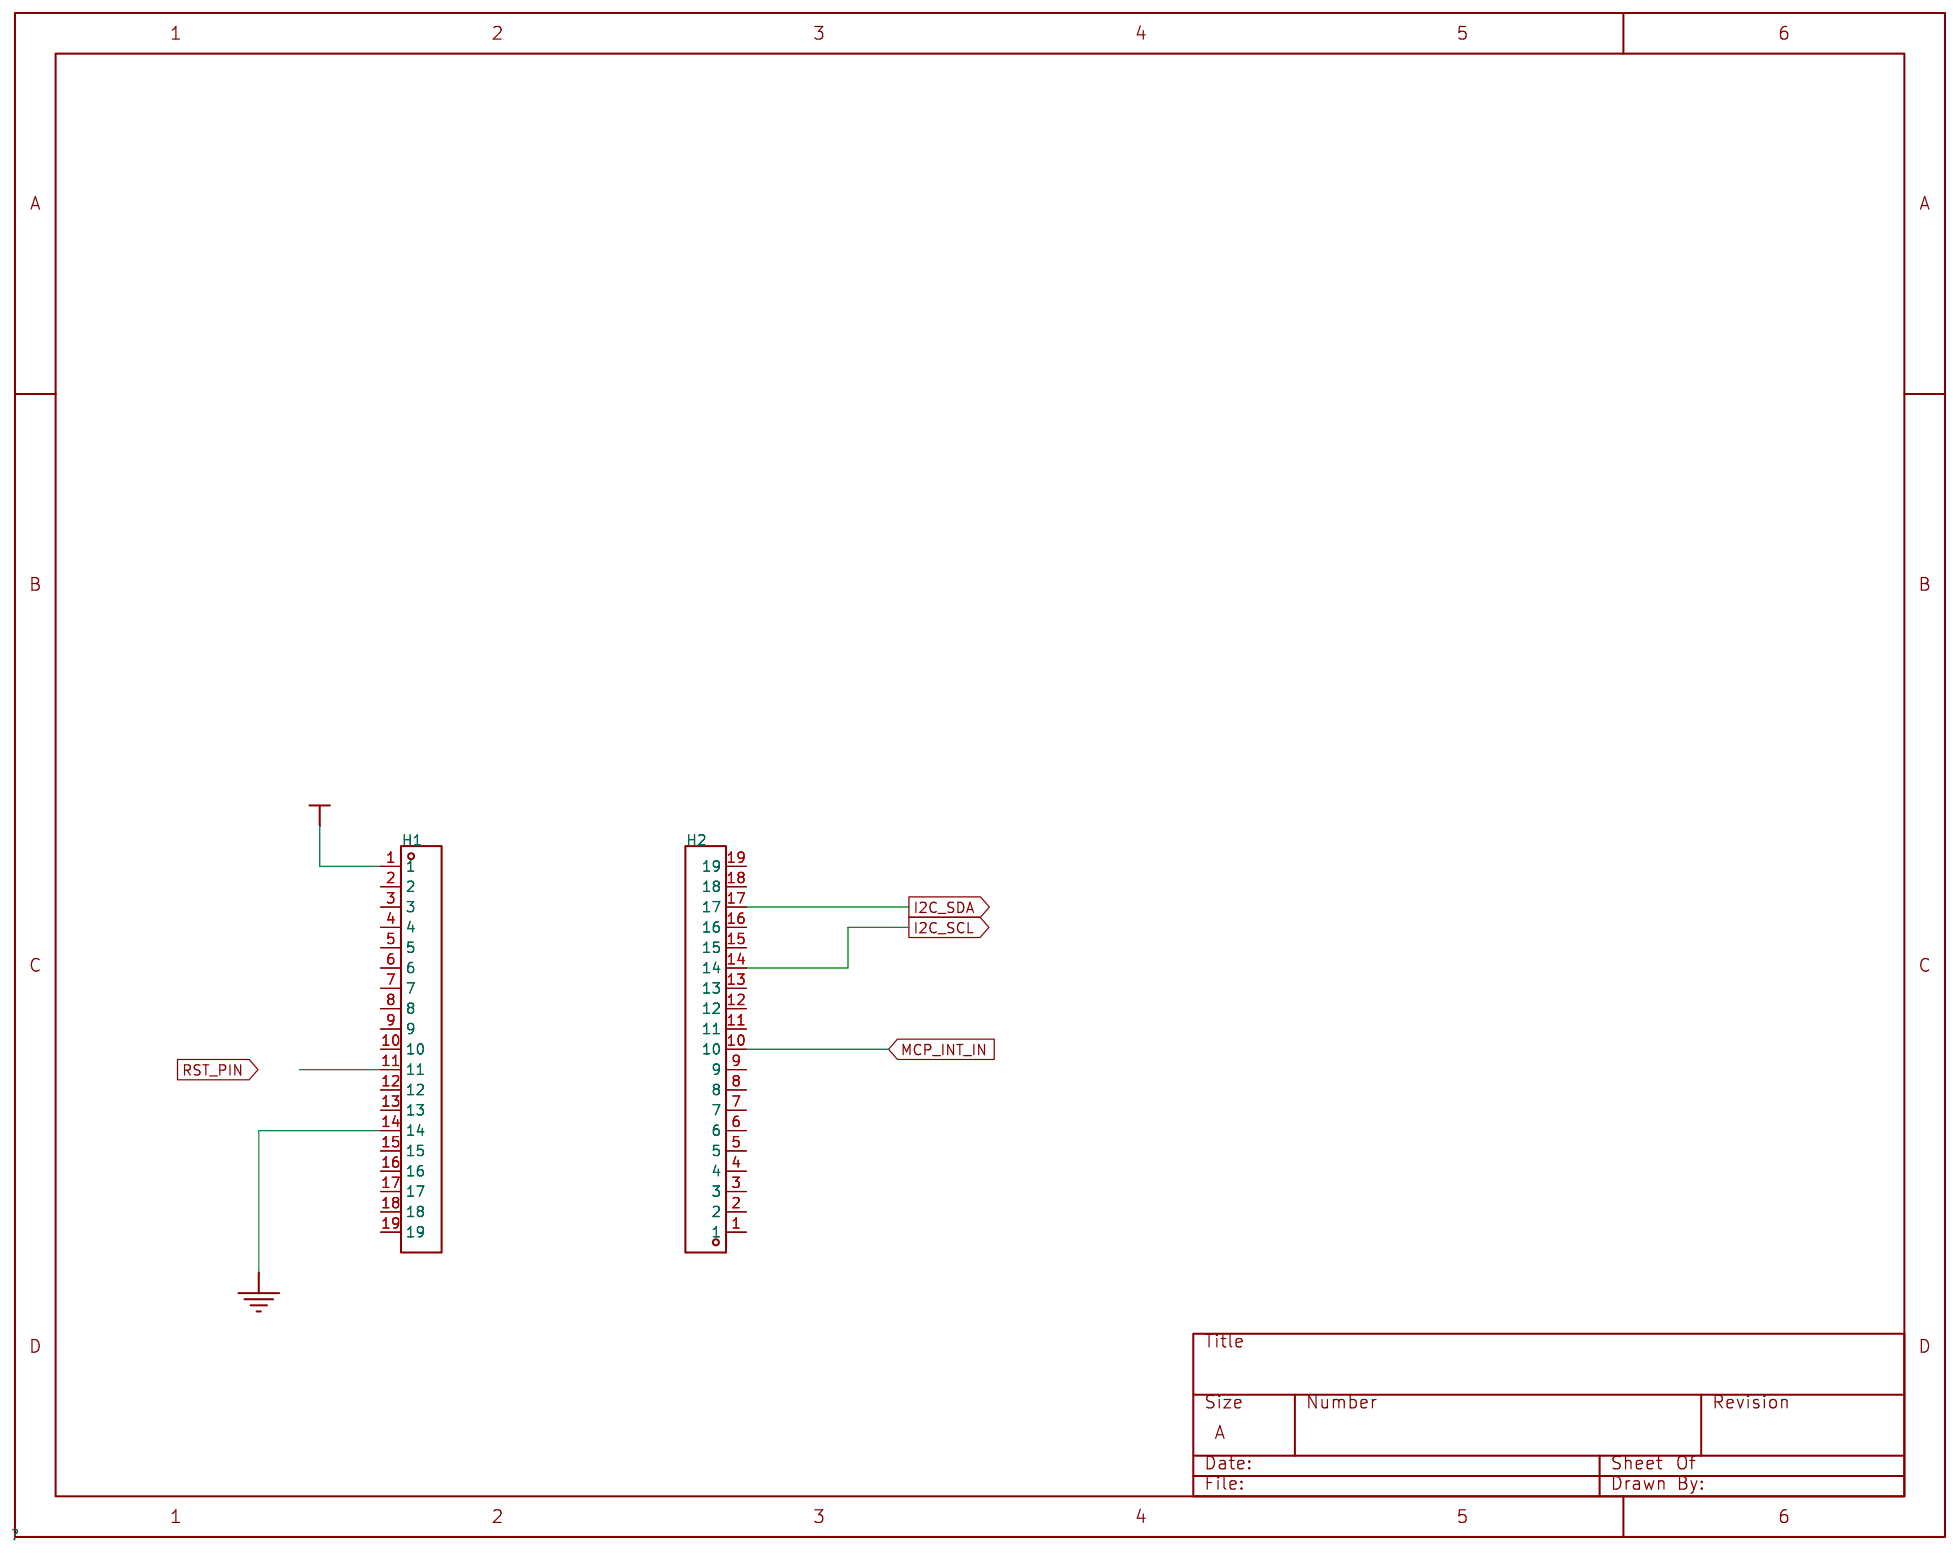
[diagram p6: schematic sheet]

## Parts
H1  2.54-1*19P母  [HDR-TH_19P-P2.54-V-F]
H2  2.54-1*19P母  [HDR-TH_19P-P2.54-V-F]

## Library data of the parts
H1 H2 = 2.54-1*19P母: LCSC Part Name: 间距:2.54mm 直插; Manufacturer: BOOMELE(博穆精密); Supplier Footprint: 插件,P=2.54mm; JLCPCB Part Class: Extended Part; Pitch: 2.54mm; Circular Hole / Square Hole: Square Hole; Mounting Type: Through Hole; Number of Rows: 1; Number of Positions: 19P; Holes Direction: Top; Supplier: LCSC; Supplier Part: C319202; Library Name: 2_54-1x19

## Nets
+3V3: H1.1
GND: H1.14
I2C_SCL: H2.14
I2C_SDA: H2.17
MCP_INT_IN: H2.10
RST_PIN: H1.11

Not connected (* = marked no-connect by the designer): H1 2 3 4 5 6 7 8 9 10 12 13 15 16 17 18 19; H2 1 2 3 4 5 6 7 8 9 11 12 13 15 16 18 19

# Schematic System_Controller
Create Date: 2026-02-14; Page Name: System_Controller; Project Name: Smart_Plugs; Schematic Name: System_Controller; Update Date: 2026-03-09; Address1: *; Address2: *; Address3: *; Address4: *; Application_BuildNumber: *; ApprovedBy: *; Author: *; CheckedBy: *; CompanyName: *; CurrentDate: *; CurrentTime: *; Date: *; DocumentFullPathAndName: *; DocumentName: *; DocumentNumber: *; DrawnBy: *; Engineer: *; ImagePath: *; ModifiedDate: *; Organization: *; ProjectName: *; Revision: *; Rule: *; SheetNumber: 8; SheetTotal: 10; Time: *; Title: *
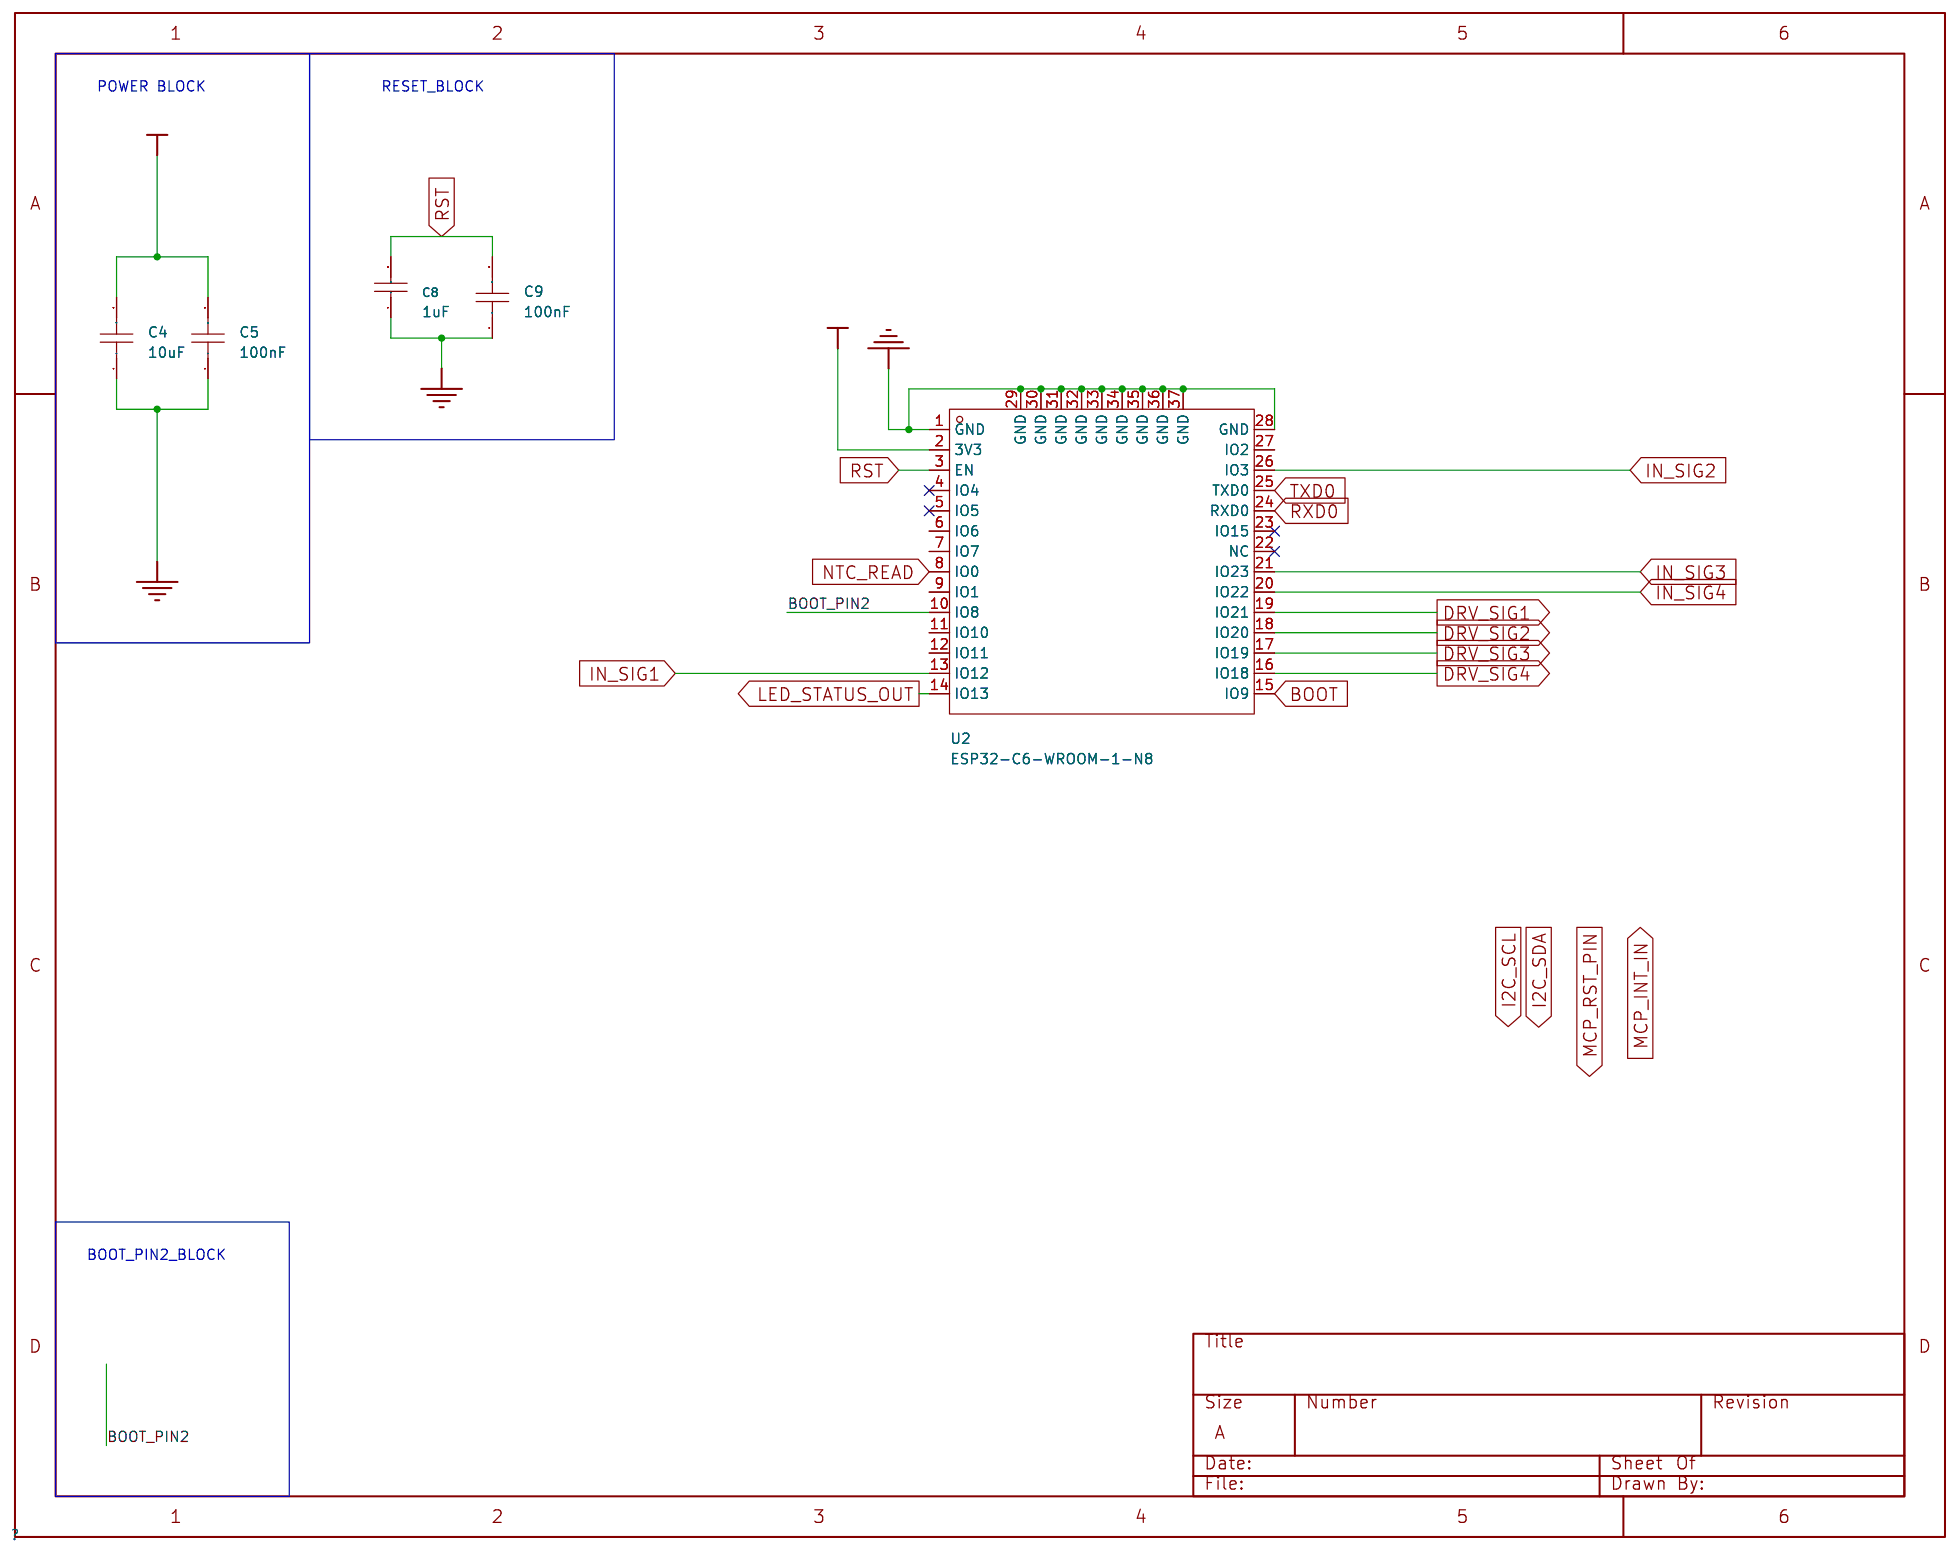
[diagram p7: schematic sheet]

## Parts
?#8  -
C4  10uF  [C0603]
C5  100nF  [C0402]
C8  1uF  [C0402]
C9  100nF  [C0402]
U2  ESP32-C6-WROOM-1-N8  [WIRELM-SMD_ESP32-C6-WROOM-1]

## Library data of the parts
C4 = CL10A106KP8NNNC: LCSC Part Name: 10uF ±10% 10V; Supplier Part: C19702; Manufacturer: SAMSUNG(三星); Supplier Footprint: 0603; JLCPCB Part Class: Basic Part; Datasheet: https://item.szlcsc.com/datasheet/CL10A106KP8NNNC/20411.html; Supplier: LCSC; Tolerance: ±10%; Voltage Rating: 10V; Temperature Coefficient: X5R
C5 C9 = CL05B104KO5NNNC: LCSC Part Name: 100nF ±10% 16V; Supplier Part: C1525; Manufacturer: SAMSUNG(三星); Supplier Footprint: 0402; JLCPCB Part Class: Basic Part; Datasheet: https://item.szlcsc.com/datasheet/CL05B104KO5NNNC/1877.html; Supplier: LCSC; Tolerance: ±10%; Voltage Rating: 16V; Temperature Coefficient: X7R
C8 = CL05A105KO5NNNC: LCSC Part Name: 1uF ±10% 16V; Supplier Part: C29266; Manufacturer: SAMSUNG(三星); Supplier Footprint: 0402; JLCPCB Part Class: Extended Part; Datasheet: https://item.szlcsc.com/datasheet/CL05A105KO5NNNC/30018.html; Supplier: LCSC; Tolerance: ±10%; Voltage Rating: 16V; Temperature Coefficient: X5R
U2 = ESP32-C6-WROOM-1-N8: Supplier Part: C5366877; Manufacturer: ESPRESSIF(乐鑫); JLCPCB Part Class: Extended Part; Datasheet: https://item.szlcsc.com/datasheet/ESP32-C6-WROOM-1-N8/6203223.html; Supplier: LCSC

## Nets
+3V3: C4.2 C5.2 U2.2(3V3)
GND: C4.1 C5.1 C8.1 C9.1 U2.1(GND) U2.28(GND) U2.29(GND) U2.30(GND) U2.31(GND) U2.32(GND) U2.33(GND) U2.34(GND) U2.35(GND) U2.36(GND) U2.37(GND)
BOOT: U2.15(IO9)
BOOT_PIN2: ?#8.(IN) U2.10(IO8)
DRV_SIG1: U2.19(IO21)
DRV_SIG2: U2.18(IO20)
DRV_SIG3: U2.17(IO19)
DRV_SIG4: U2.16(IO18)
IN_SIG1: U2.13(IO12)
IN_SIG2: U2.26(IO3)
IN_SIG3: U2.21(IO23)
IN_SIG4: U2.20(IO22)
LED_STATUS_OUT: U2.14(IO13)
NTC_READ: U2.8(IO0)
RST: C8.2 C9.2 U2.3(EN)
RXD0: U2.24(RXD0)
TXD0: U2.25(TXD0)

Not connected (* = marked no-connect by the designer): U2 4(IO4)* 5(IO5)* 6(IO6) 7(IO7) 9(IO1) 11(IO10) 12(IO11) 22(NC)* 23(IO15)* 27(IO2)

## Notes on the sheet
- POWER BLOCK
- RESET_BLOCK
- BOOT_PIN2_BLOCK

# Schematic UART_Prog
Create Date: 2026-02-14; Page Name: Uart_Prog; Project Name: Smart_Plugs; Schematic Name: UART_Prog; Update Date: 2026-03-07; Company: EasyEDA.com; Page Size: A4; Version: V1.0
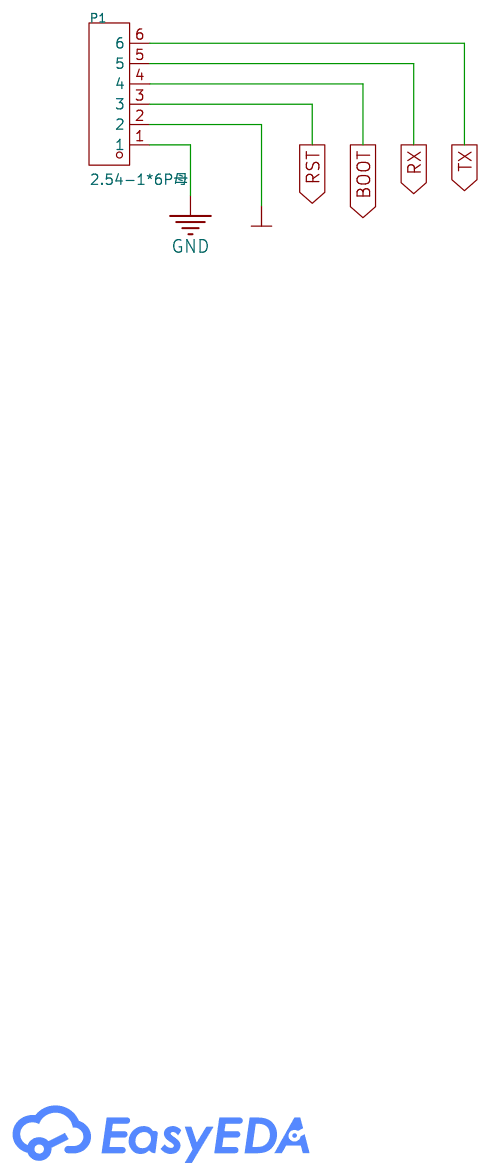
[diagram p8: schematic sheet]

## Parts
P1  2.54-1*6P母  [HDR-TH_6P-P2.54-V-F]

## Library data of the parts
P1 = 2.54-1*6P母: LCSC Part Name: 1x6P 间距:2.54mm 直插; Supplier Part: C40877; Manufacturer: BOOMELE(博穆精密); Supplier Footprint: 插件,P=2.54mm; JLCPCB Part Class: Extended Part; Datasheet: https://item.szlcsc.com/datasheet/2.54-1*6P%25E6%25AF%258D/41861.html; Supplier: LCSC; Holes Structure: 1x6P; Pitch: 2.54mm; Circular Hole / Square Hole: Square Hole; Mounting Type: Through Hole; Number of Rows: 1; Number of Positions: 6P; Current Rating: 3A; Holes Direction: Top; Contact Material: Brass; Operating Temperature: -40℃~+105℃; PIN Length: 3.3mm

## Nets
+3V3: P1.2
GND: P1.1
BOOT: P1.4
RST: P1.3
RX: P1.5
TX: P1.6

# Schematic MAIN_ONLY_CTRL
Board Name: MAIN; Create Date: 2026-02-14; Page Name: MAIN_ONLY_CTRL; Project Name: Smart_Plugs; Schematic Name: MAIN_ONLY_CTRL; Update Date: 2026-03-03; Address1: *; Address2: *; Address3: *; Address4: *; Application_BuildNumber: *; ApprovedBy: *; Author: *; CheckedBy: *; CompanyName: *; CurrentDate: *; CurrentTime: *; Date: *; DocumentFullPathAndName: *; DocumentName: *; DocumentNumber: *; DrawnBy: *; Engineer: *; ImagePath: *; ModifiedDate: *; Organization: *; ProjectName: *; Revision: *; Rule: *; SheetNumber: 8; SheetTotal: 10; Time: *; Title: *
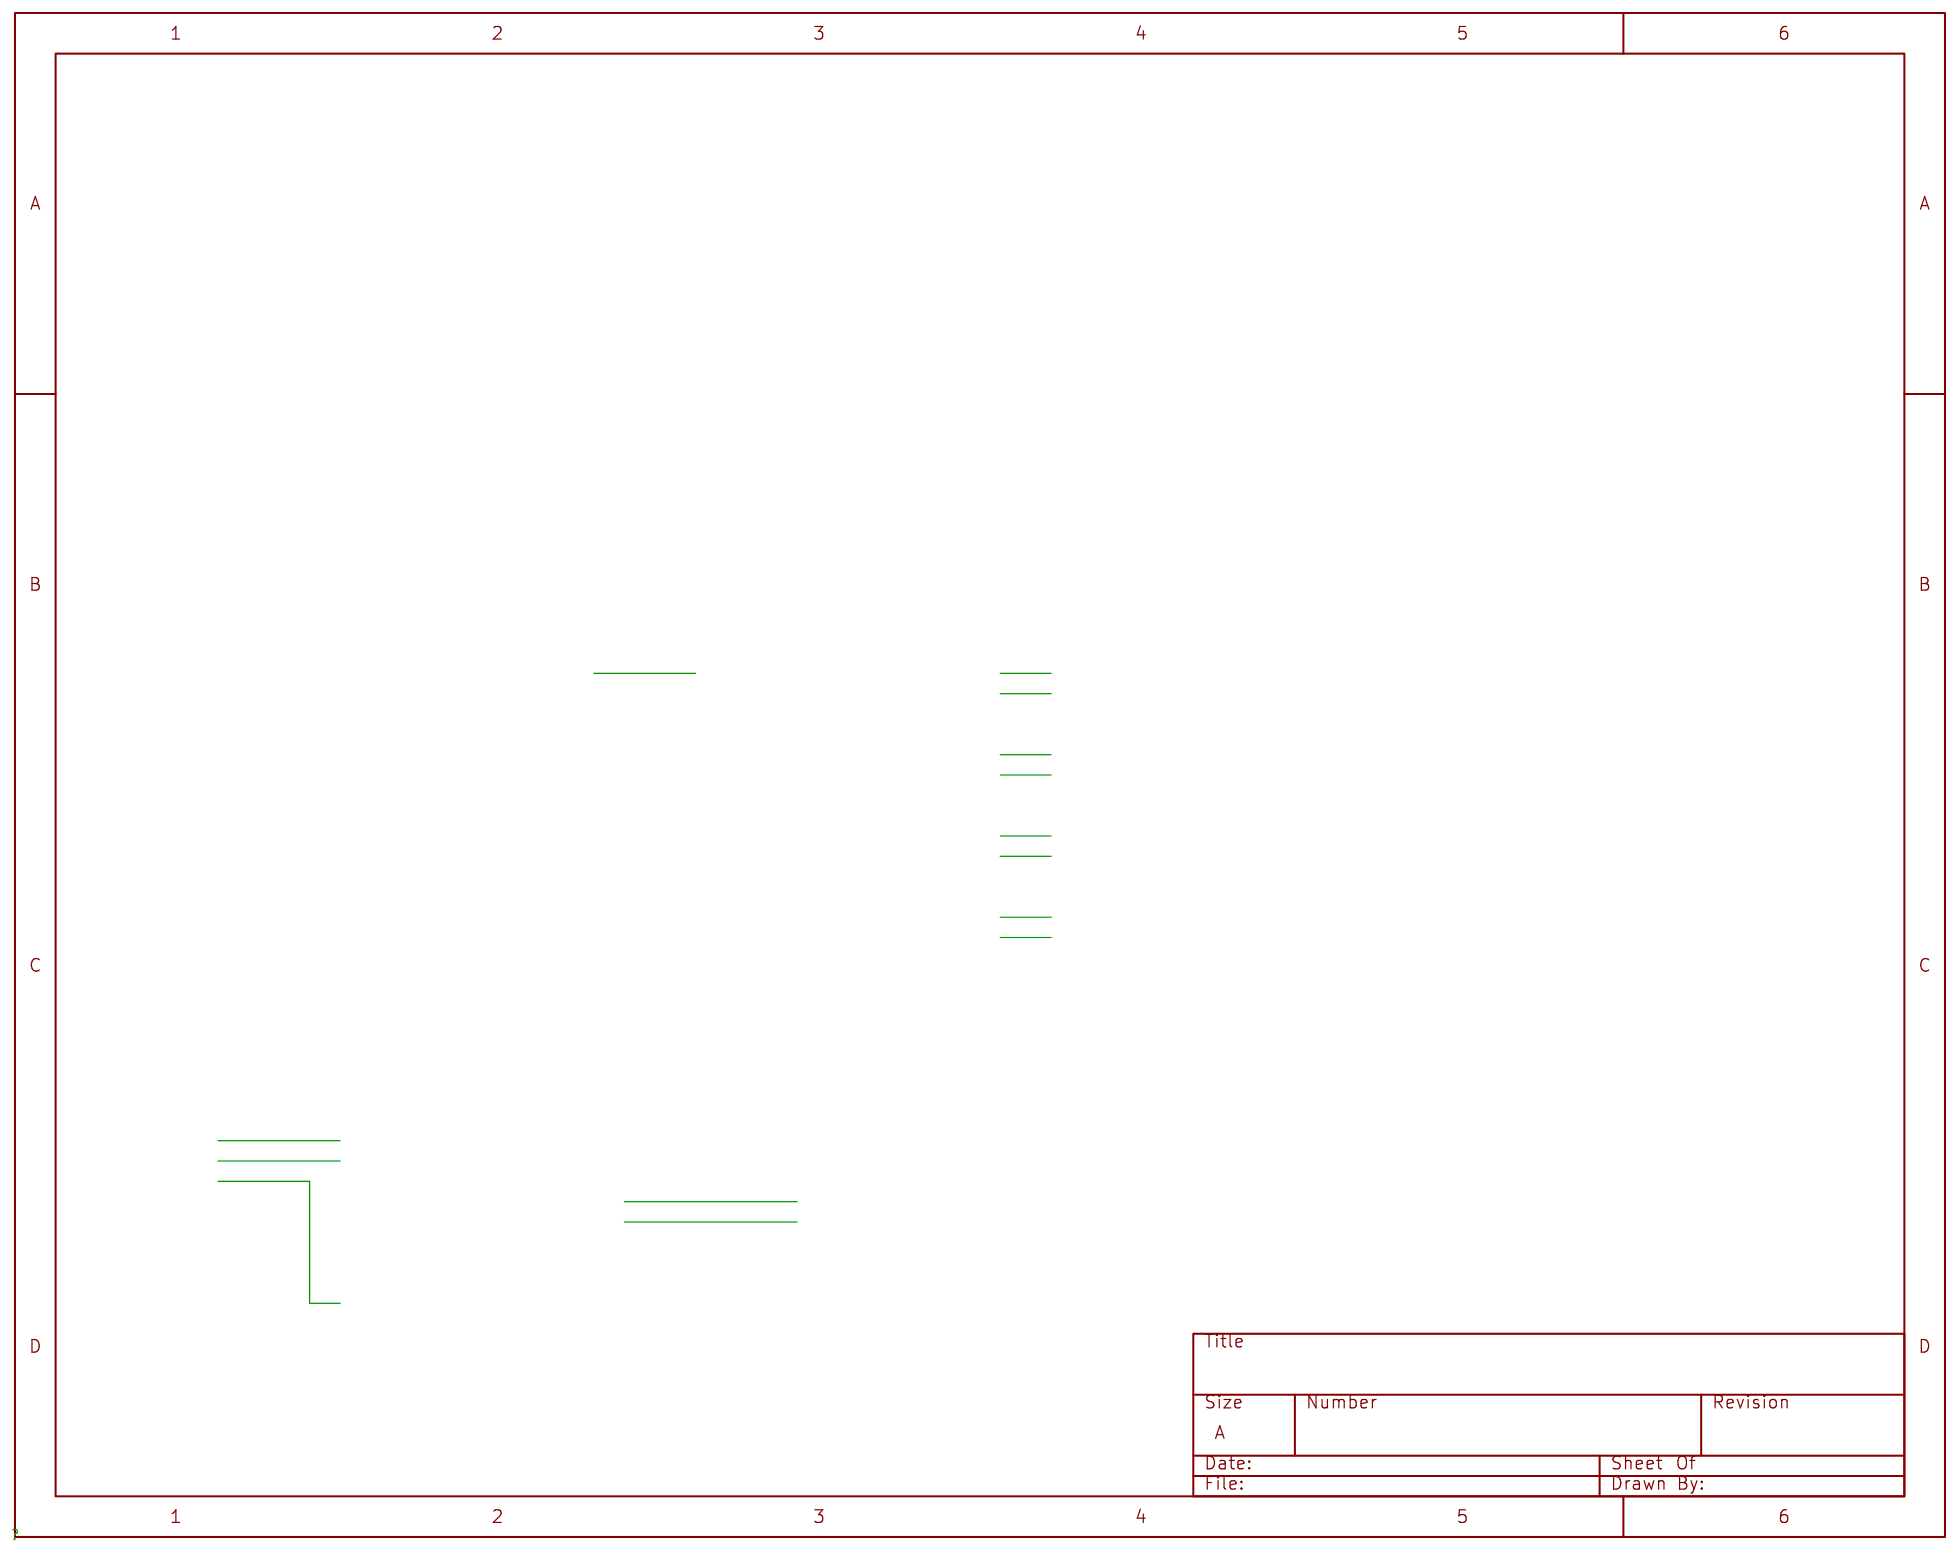
[diagram p9: schematic sheet]

## Parts
AC_IN_PORT_BLOCK  -
NTC_Block1  -
PSU_5LS05_BLOCK  -
RELAY_CHANNEL1  -
RELAY_CHANNEL2  -
RELAY_CHANNEL3  -
RELAY_CHANNEL4  -
U_EARTH_CONNECTORS  -
U_PSU_INPUT_EMI_PROTECTION1  -
UI_Main_Connector_Block  -

## Nets
Net-(AC_IN_PORT_BLOCK-): AC_IN_PORT_BLOCK.(AC_PE) PSU_5LS05_BLOCK.(AC_FILTERED_N_IN) U_EARTH_CONNECTORS.(AC_PE) U_PSU_INPUT_EMI_PROTECTION1.(AC_N_FILTERED_OUT)
Net-(NTC_Block1-): NTC_Block1.(NTC_READ) RELAY_CHANNEL1.(LED_IND_IN) RELAY_CHANNEL2.(LED_IND_IN) RELAY_CHANNEL3.(LED_IND_IN) RELAY_CHANNEL4.(LED_IND_IN) UI_Main_Connector_Block.(DRV_SIG4)
